# EAGLE design motor_board (EAGLE 8.3.2)
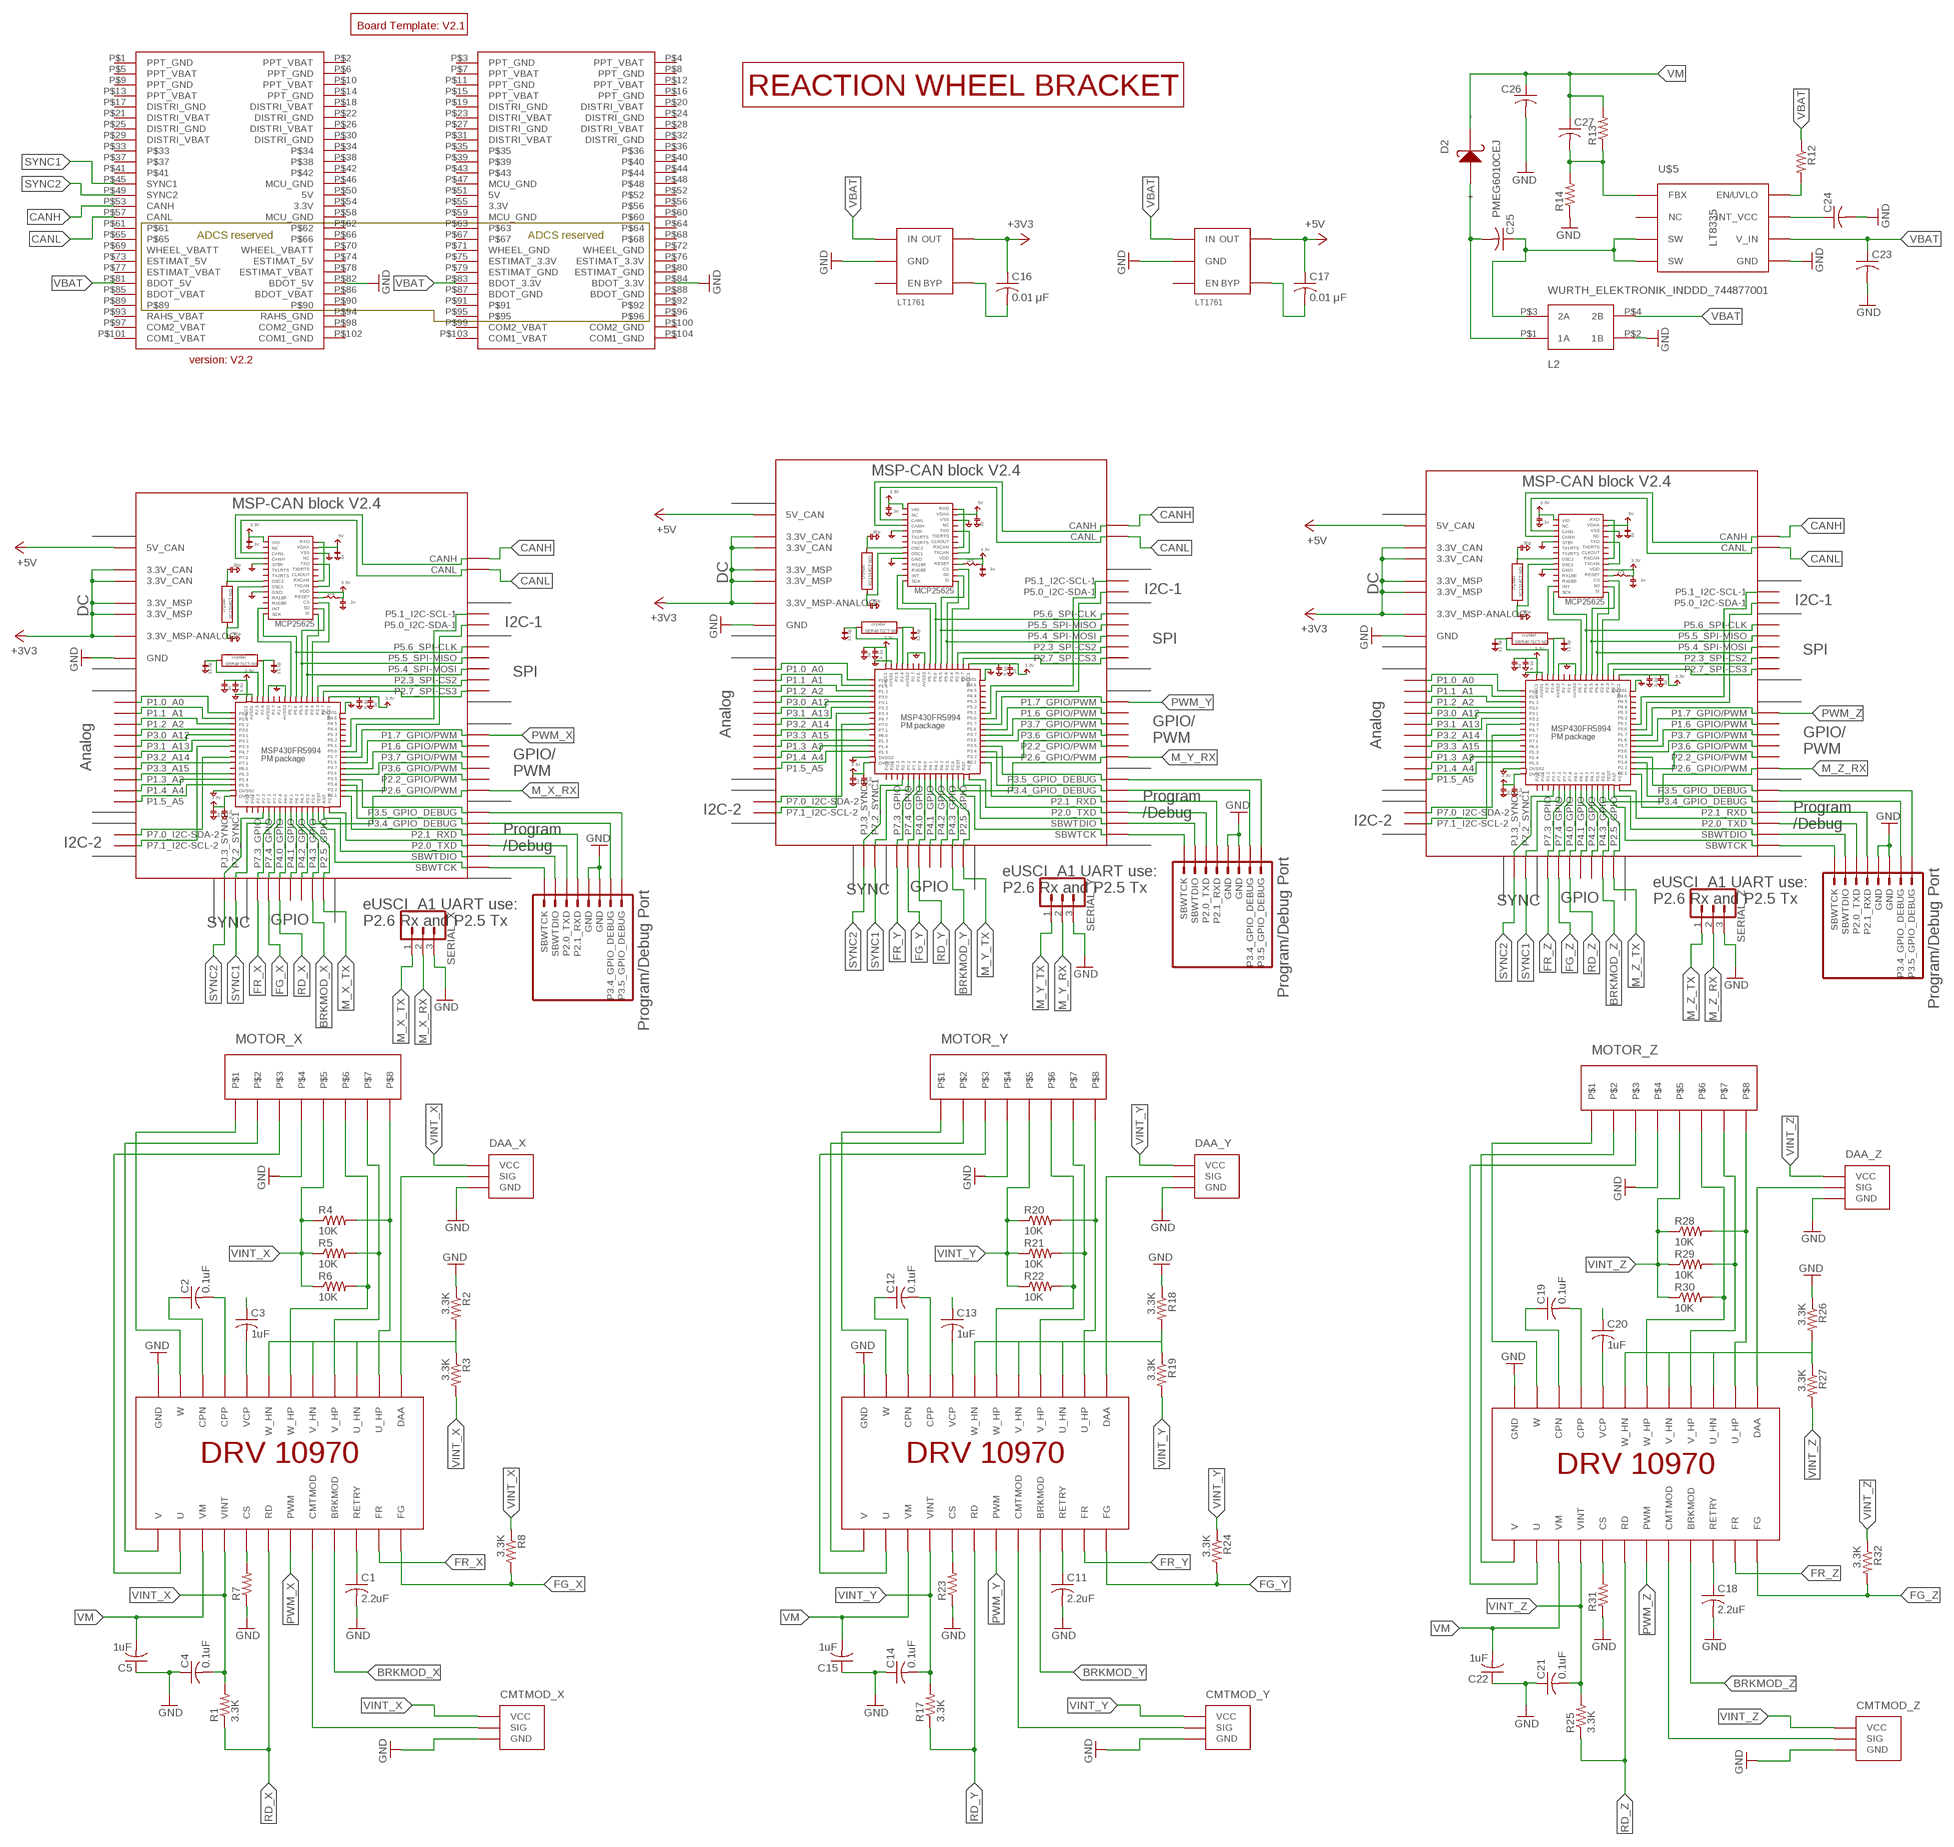
[diagram p0: schematic, sheet 1]

## Parts
C1  2.2uF  C-USC1206  [C1206]
C2  0.1uF  C-USC0805  [C0805]
C3  1uF  C-USC1206  [C1206]
C4  0.1uF  C-USC0805  [C0805]
C5  1uF  C-USC1206  [C1206]
C11  2.2uF  C-USC1206  [C1206]
C12  0.1uF  C-USC0805  [C0805]
C13  1uF  C-USC1206  [C1206]
C14  0.1uF  C-USC0805  [C0805]
C15  1uF  C-USC1206  [C1206]
C16  0.01 μF  C-USC0805  [C0805]
C17  0.01 μF  C-USC0805  [C0805]
C18  2.2uF  C-USC1206  [C1206]
C19  0.1uF  C-USC0805  [C0805]
C20  1uF  C-USC1206  [C1206]
C21  0.1uF  C-USC0805  [C0805]
C22  1uF  C-USC1206  [C1206]
C23  C-USC0805  [C0805]
C24  C-USC0805  [C0805]
C25  C-USC0805  [C0805]
C26  C-USC0805  [C0805]
C27  C-USC0805  [C0805]
CMTMOD_X  0_OHM_JUMPER  [0_OHM_JUMPER]
CMTMOD_Y  0_OHM_JUMPER  [0_OHM_JUMPER]
CMTMOD_Z  0_OHM_JUMPER  [0_OHM_JUMPER]
D2  PMEG6010CEJ  [SC-90]
DAA_X  0_OHM_JUMPER  [0_OHM_JUMPER]
DAA_Y  0_OHM_JUMPER  [0_OHM_JUMPER]
DAA_Z  0_OHM_JUMPER  [0_OHM_JUMPER]
L2  WURTH_ELEKTRONIK_INDDD_744877001  [WURTH_ELEKTRONIK_INDDD_744877001]
LDO_3V3  LINEAR_LDO_LT1761-X  [SOT-23-5]
LDO_5V  LINEAR_LDO_LT1761-X  [SOT-23-5]
MOTOR_X  PICOLOCK_8  [PICOLOCK_8]
MOTOR_Y  PICOLOCK_8  [PICOLOCK_8]
MOTOR_Z  PICOLOCK_8  [PICOLOCK_8]
R1  3.3K  R-US_R0805  [R0805]
R2  3.3K  R-US_R0805  [R0805]
R3  3.3K  R-US_R0805  [R0805]
R4  10K  R-US_R0805  [R0805]
R5  10K  R-US_R0805  [R0805]
R6  10K  R-US_R0805  [R0805]
R7  R-US_R0805  [R0805]
R8  3.3K  R-US_R0805  [R0805]
R12  R-US_R0805  [R0805]
R13  R-US_R0805  [R0805]
R14  R-US_R0805  [R0805]
R17  3.3K  R-US_R0805  [R0805]
R18  3.3K  R-US_R0805  [R0805]
R19  3.3K  R-US_R0805  [R0805]
R20  10K  R-US_R0805  [R0805]
R21  10K  R-US_R0805  [R0805]
R22  10K  R-US_R0805  [R0805]
R23  R-US_R0805  [R0805]
R24  3.3K  R-US_R0805  [R0805]
R25  3.3K  R-US_R0805  [R0805]
R26  3.3K  R-US_R0805  [R0805]
R27  3.3K  R-US_R0805  [R0805]
R28  10K  R-US_R0805  [R0805]
R29  10K  R-US_R0805  [R0805]
R30  10K  R-US_R0805  [R0805]
R31  R-US_R0805  [R0805]
R32  3.3K  R-US_R0805  [R0805]
SERIAL_X  CONN_03LOCK  [1X03_LOCK]
SERIAL_Y  CONN_03LOCK  [1X03_LOCK]
SERIAL_Z  CONN_03LOCK  [1X03_LOCK]
U$1  BOARD_TEMPLATE  [BOARD_TEMPLATE]
U$2  PC104_CONNECTOR  [PC104_CONNECTOR]
U$3  MSP-CAN_BLOCK  [MSP-CAN_BLOCK]
U$4  PROGRAM/DEBUG_PORT  [1X08_CONNECTOR]
U$5  LT8335  [DDB]
U$7  DRV10970  [DRV10970]
U$9  REACTION_WHEEL_BRACKET  [REACTION_WHEEL_BRACKET]
U$10  MSP-CAN_BLOCK  [MSP-CAN_BLOCK]
U$11  PROGRAM/DEBUG_PORT  [1X08_CONNECTOR]
U$12  DRV10970  [DRV10970]
U$13  MSP-CAN_BLOCK  [MSP-CAN_BLOCK]
U$14  PROGRAM/DEBUG_PORT  [1X08_CONNECTOR]
U$15  DRV10970  [DRV10970]

## Nets
+3V3: C16.1 LDO_3V3.P$5(OUT) U$3.3.3V@CAN1(3.3V_CAN) U$3.3.3V@CAN2(3.3V_CAN) U$3.3.3V@MSP1(3.3V_MSP) U$3.3.3V@MSP2(3.3V_MSP) U$3.3.3V_ANALOG@MSP2(3.3V_MSP-ANALOG) U$10.3.3V@CAN1(3.3V_CAN) U$10.3.3V@CAN2(3.3V_CAN) U$10.3.3V@MSP1(3.3V_MSP) U$10.3.3V@MSP2(3.3V_MSP) U$10.3.3V_ANALOG@MSP2(3.3V_MSP-ANALOG) U$13.3.3V@CAN1(3.3V_CAN) U$13.3.3V@CAN2(3.3V_CAN) U$13.3.3V@MSP1(3.3V_MSP) U$13.3.3V@MSP2(3.3V_MSP) U$13.3.3V_ANALOG@MSP2(3.3V_MSP-ANALOG)
+5V: C17.1 LDO_5V.P$5(OUT) U$3.5V(5V_CAN) U$10.5V(5V_CAN) U$13.5V(5V_CAN)
BRKMOD_X: U$3.P4.3_GPIO U$7.BRKMOD
BRKMOD_Y: U$10.P4.3_GPIO U$12.BRKMOD
BRKMOD_Z: U$13.P4.3_GPIO U$15.BRKMOD
CANH: U$2.P$53(CANH) U$3.CANH U$10.CANH U$13.CANH
CANL: U$2.P$57(CANL) U$3.CANL U$10.CANL U$13.CANL
CMTMOD_X: CMTMOD_X.P$2(SIG) U$7.CMTMOD
CMTMOD_Y: CMTMOD_Y.P$2(SIG) U$12.CMTMOD
CMTMOD_Z: CMTMOD_Z.P$2(SIG) U$15.CMTMOD
CPN_X: C2.1 U$7.CPN
CPN_Y: C12.1 U$12.CPN
CPN_Z: C19.1 U$15.CPN
CPP_X: C2.2 U$7.CPP
CPP_Y: C12.2 U$12.CPP
CPP_Z: C19.2 U$15.CPP
CS_X: R7.2 U$7.CS
CS_Y: R23.2 U$12.CS
CS_Z: R31.2 U$15.CS
DAA_X: DAA_X.P$2(SIG) U$7.DAA
DAA_Y: DAA_Y.P$2(SIG) U$12.DAA
DAA_Z: DAA_Z.P$2(SIG) U$15.DAA
EN_UVLO: R12.2 U$5.P$8(EN/UVLO)
FBX: C27.2 R13.1 R14.2 U$5.P$1(FBX)
FG_X: R8.2 U$3.P7.4_GPIO U$7.FG
FG_Y: R24.2 U$10.P7.4_GPIO U$12.FG
FG_Z: R32.2 U$13.P7.4_GPIO U$15.FG
FR_X: U$3.P7.3_GPIO U$7.FR
FR_Y: U$10.P7.3_GPIO U$12.FR
FR_Z: U$13.P7.3_GPIO U$15.FR
GND: C1.2 C3.1 C4.1 C5.1 C11.2 C13.1 C14.1 C15.1 C18.2 C20.1 C21.1 C22.1 C23.2 C24.2 C26.2 CMTMOD_X.P$1(GND) CMTMOD_Y.P$1(GND) CMTMOD_Z.P$1(GND) DAA_X.P$1(GND) DAA_Y.P$1(GND) DAA_Z.P$1(GND) L2.P$2(1B) LDO_3V3.P$2(GND) LDO_5V.P$2(GND) MOTOR_X.P$4 MOTOR_Y.P$4 MOTOR_Z.P$4 R2.1 R7.1 R14.1 R18.1 R23.1 R26.1 R31.1 SERIAL_X.3 SERIAL_Y.3 SERIAL_Z.3 U$2.P$82(BDOT_5V) U$2.P$84(BDOT_3.3V) U$3.GND@1(GND) U$3.GND@2(GND) U$3.GND@3(GND) U$3.GND@4(GND) U$3.GND@5(GND) U$3.GND@7(GND) U$3.GND@8(GND) U$3.GND@9(GND) U$3.GND@10(GND) U$3.GND@11(GND) U$3.GND@12(GND) U$3.GND@13(GND) U$3.GND@14(GND) U$3.GND@15(GND) U$3.GND@16(GND) U$3.GND@17(GND) U$3.GND@26(GND) U$4.5(GND) U$4.6(GND) U$5.GND U$5.P$5(GND) U$7.GND@1(GND) U$7.GND@2(GND) U$10.GND@1(GND) U$10.GND@2(GND) U$10.GND@3(GND) U$10.GND@4(GND) U$10.GND@5(GND) U$10.GND@7(GND) U$10.GND@8(GND) U$10.GND@9(GND) U$10.GND@10(GND) U$10.GND@11(GND) U$10.GND@12(GND) U$10.GND@13(GND) U$10.GND@14(GND) U$10.GND@15(GND) U$10.GND@16(GND) U$10.GND@17(GND) U$10.GND@26(GND) U$11.5(GND) U$11.6(GND) U$12.GND@1(GND) U$12.GND@2(GND) U$13.GND@1(GND) U$13.GND@2(GND) U$13.GND@3(GND) U$13.GND@4(GND) U$13.GND@5(GND) U$13.GND@7(GND) U$13.GND@8(GND) U$13.GND@9(GND) U$13.GND@10(GND) U$13.GND@11(GND) U$13.GND@12(GND) U$13.GND@13(GND) U$13.GND@14(GND) U$13.GND@15(GND) U$13.GND@16(GND) U$13.GND@17(GND) U$13.GND@26(GND) U$14.5(GND) U$14.6(GND) U$15.GND@1(GND) U$15.GND@2(GND)
GPIO_DEBUG_3.4_X: U$3.P3.4_GPIO_DEBUG U$4.7(P3.4_GPIO_DEBUG)
GPIO_DEBUG_3.4_Y: U$10.P3.4_GPIO_DEBUG U$11.7(P3.4_GPIO_DEBUG)
GPIO_DEBUG_3.4_Z: U$13.P3.4_GPIO_DEBUG U$14.7(P3.4_GPIO_DEBUG)
GPIO_DEBUG_3.5_X: U$3.P3.5_GPIO_DEBUG U$4.8(P3.5_GPIO_DEBUG)
GPIO_DEBUG_3.5_Y: U$10.P3.5_GPIO_DEBUG U$11.8(P3.5_GPIO_DEBUG)
GPIO_DEBUG_3.5_Z: U$13.P3.5_GPIO_DEBUG U$14.8(P3.5_GPIO_DEBUG)
HN_X: R2.2 R3.1 U$7.U_HN U$7.V_HN U$7.W_HN
HN_Y: R18.2 R19.1 U$12.U_HN U$12.V_HN U$12.W_HN
HN_Z: R26.2 R27.1 U$15.U_HN U$15.V_HN U$15.W_HN
HP_U_X: MOTOR_X.P$8 R4.2 U$7.U_HP
HP_U_Y: MOTOR_Y.P$8 R20.2 U$12.U_HP
HP_U_Z: MOTOR_Z.P$8 R28.2 U$15.U_HP
HP_V_X: MOTOR_X.P$7 R5.2 U$7.V_HP
HP_V_Y: MOTOR_Y.P$7 R21.2 U$12.V_HP
HP_V_Z: MOTOR_Z.P$7 R29.2 U$15.V_HP
HP_W_X: MOTOR_X.P$6 R6.2 U$7.W_HP
HP_W_Y: MOTOR_Y.P$6 R22.2 U$12.W_HP
HP_W_Z: MOTOR_Z.P$6 R30.2 U$15.W_HP
INT_VCC: C24.1 U$5.P$7(INT_VCC)
M_X_RX: SERIAL_X.2 U$3.P2.6_GPIO/PWM
M_X_TX: SERIAL_X.1 U$3.P2.5_GPIO
M_Y_RX: SERIAL_Y.2 U$10.P2.6_GPIO/PWM
M_Y_TX: SERIAL_Y.1 U$10.P2.5_GPIO
M_Z_RX: SERIAL_Z.2 U$13.P2.6_GPIO/PWM
M_Z_TX: SERIAL_Z.1 U$13.P2.5_GPIO
N$1: C25.2 D2.P$1(+) L2.P$1(1A)
N$13: C17.2 LDO_5V.P$4(BYP)
N$14: C16.2 LDO_3V3.P$4(BYP)
PWM_X: U$3.P1.7_GPIO/PWM U$7.PWM
PWM_Y: U$10.P1.7_GPIO/PWM U$12.PWM
PWM_Z: U$13.P1.7_GPIO/PWM U$15.PWM
RD_X: R1.1 U$3.P4.0_GPIO U$7.RD
RD_Y: R17.1 U$10.P4.0_GPIO U$12.RD
RD_Z: R25.1 U$13.P4.0_GPIO U$15.RD
RETRY_X: C1.1 U$7.RETRY
RETRY_Y: C11.1 U$12.RETRY
RETRY_Z: C18.1 U$15.RETRY
RXD_X: U$3.P2.1_RXD U$4.4(P2.1_RXD)
RXD_Y: U$10.P2.1_RXD U$11.4(P2.1_RXD)
RXD_Z: U$13.P2.1_RXD U$14.4(P2.1_RXD)
SBWTCK_X: U$3.SBWTCK U$4.SBWTCK
SBWTCK_Y: U$10.SBWTCK U$11.SBWTCK
SBWTCK_Z: U$13.SBWTCK U$14.SBWTCK
SBWTDIO_X: U$3.SBWTDIO U$4.2(SBWTDIO)
SBWTDIO_Y: U$10.SBWTDIO U$11.2(SBWTDIO)
SBWTDIO_Z: U$13.SBWTDIO U$14.2(SBWTDIO)
SW: C25.1 L2.P$3(2A) U$5.P$3(SW) U$5.P$4(SW)
SYNC1: U$2.P$45(SYNC1) U$3.P7.2_SYNC1 U$10.P7.2_SYNC1 U$13.P7.2_SYNC1
SYNC2: U$2.P$49(SYNC2) U$3.PJ.3_SYNC2 U$10.PJ.3_SYNC2 U$13.PJ.3_SYNC2
TXD_X: U$3.P2.0_TXD U$4.3(P2.0_TXD)
TXD_Y: U$10.P2.0_TXD U$11.3(P2.0_TXD)
TXD_Z: U$13.P2.0_TXD U$14.3(P2.0_TXD)
U_X: MOTOR_X.P$3 U$7.U
U_Y: MOTOR_Y.P$3 U$12.U
U_Z: MOTOR_Z.P$3 U$15.U
V_X: MOTOR_X.P$2 U$7.V
V_Y: MOTOR_Y.P$2 U$12.V
V_Z: MOTOR_Z.P$2 U$15.V
VBAT: C23.1 L2.P$4(2B) LDO_3V3.P$1(IN) LDO_5V.P$1(IN) R12.1 U$2.P$81(BDOT_5V) U$2.P$83(BDOT_3.3V) U$5.P$6(V_IN)
VCP_X: C3.2 U$7.VCP
VCP_Y: C13.2 U$12.VCP
VCP_Z: C20.2 U$15.VCP
VINT_X: C4.2 CMTMOD_X.P$3(VCC) DAA_X.P$3(VCC) MOTOR_X.P$5 R1.2 R3.2 R4.1 R5.1 R6.1 R8.1 U$7.VINT
VINT_Y: C14.2 CMTMOD_Y.P$3(VCC) DAA_Y.P$3(VCC) MOTOR_Y.P$5 R17.2 R19.2 R20.1 R21.1 R22.1 R24.1 U$12.VINT
VINT_Z: C21.2 CMTMOD_Z.P$3(VCC) DAA_Z.P$3(VCC) MOTOR_Z.P$5 R25.2 R27.2 R28.1 R29.1 R30.1 R32.1 U$15.VINT
VM: C5.2 C15.2 C22.2 C26.1 C27.1 D2.P$2(-) R13.2 U$7.VM U$12.VM U$15.VM
W_X: MOTOR_X.P$1 U$7.W
W_Y: MOTOR_Y.P$1 U$12.W
W_Z: MOTOR_Z.P$1 U$15.W
Unconnected: LDO_3V3.P$3(EN) LDO_5V.P$3(EN) U$2.P$1(PPT_GND) U$2.P$2(PPT_VBAT) U$2.P$3(PPT_GND) U$2.P$4(PPT_VBAT) U$2.P$5(PPT_VBAT) U$2.P$6(PPT_GND) U$2.P$7(PPT_VBAT) U$2.P$8(PPT_GND) U$2.P$9(PPT_GND) U$2.P$10(PPT_VBAT) U$2.P$11(PPT_GND) U$2.P$12(PPT_VBAT) U$2.P$13(PPT_VBAT) U$2.P$14(PPT_GND) U$2.P$15(PPT_VBAT) U$2.P$16(PPT_GND) U$2.P$17(DISTRI_GND) U$2.P$18(DISTRI_VBAT) U$2.P$19(DISTRI_GND) U$2.P$20(DISTRI_VBAT) U$2.P$21(DISTRI_VBAT) U$2.P$22(DISTRI_GND) U$2.P$23(DISTRI_VBAT) U$2.P$24(DISTRI_GND) U$2.P$25(DISTRI_GND) U$2.P$26(DISTRI_VBAT) U$2.P$27(DISTRI_GND) U$2.P$28(DISTRI_VBAT) U$2.P$29(DISTRI_VBAT) U$2.P$30(DISTRI_GND) U$2.P$31(DISTRI_VBAT) U$2.P$32(DISTRI_GND) U$2.P$33 U$2.P$34 U$2.P$35 U$2.P$36 U$2.P$37 U$2.P$38 U$2.P$39 U$2.P$40 U$2.P$41 U$2.P$42 U$2.P$43 U$2.P$44 U$2.P$46(MCU_GND) U$2.P$47(MCU_GND) U$2.P$48 U$2.P$50(5V) U$2.P$51(5V) U$2.P$52 U$2.P$54(3.3V) U$2.P$55(3.3V) U$2.P$56 U$2.P$58(MCU_GND) U$2.P$59(MCU_GND) U$2.P$60 U$2.P$61 U$2.P$62 U$2.P$63 U$2.P$64 U$2.P$65 U$2.P$66 U$2.P$67 U$2.P$68 U$2.P$69(WHEEL_VBATT) U$2.P$70(WHEEL_VBATT) U$2.P$71(WHEEL_GND) U$2.P$72(WHEEL_GND) U$2.P$73(ESTIMAT_5V) U$2.P$74(ESTIMAT_5V) U$2.P$75(ESTIMAT_3.3V) U$2.P$76(ESTIMAT_3.3V) U$2.P$77(ESTIMAT_VBAT) U$2.P$78(ESTIMAT_VBAT) U$2.P$79(ESTIMAT_GND) U$2.P$80(ESTIMAT_GND) U$2.P$85(BDOT_VBAT) U$2.P$86(BDOT_VBAT) U$2.P$87(BDOT_GND) U$2.P$88(BDOT_GND) U$2.P$89 U$2.P$90 U$2.P$91 U$2.P$92 U$2.P$93(RAHS_VBAT) U$2.P$94(RAHS_GND) U$2.P$95 U$2.P$96 U$2.P$97(COM2_VBAT) U$2.P$98(COM2_GND) U$2.P$99(COM2_VBAT) U$2.P$100(COM2_GND) U$2.P$101(COM1_VBAT) U$2.P$102(COM1_GND) U$2.P$103(COM1_VBAT) U$2.P$104(COM1_GND) U$3.P1.0_A0 U$3.P1.1_A1 U$3.P1.2_A2 U$3.P1.3_A3 U$3.P1.4_A4 U$3.P1.5_A5 U$3.P1.6_GPIO/PWM U$3.P2.2_GPIO/PWM U$3.P2.4_SPI-CS2(P2.3_SPI-CS2) U$3.P2.7_SPI-CS3 U$3.P3.0_A12 U$3.P3.1_A13 U$3.P3.2_A14 U$3.P3.3_A15 U$3.P3.6_GPIO/PWM U$3.P3.7_GPIO/PWM U$3.P4.1_GPIO U$3.P4.2_GPIO U$3.P5.0_I2C-SDA-1 U$3.P5.1_I2C-SCL-1 U$3.P5.4_SPI-MOSI U$3.P5.5_SPI-MISO U$3.P5.6_SPI-CLK U$3.P7.0_I2C-SDA-2 U$3.P7.1_I2C-SCL-2 U$5.P$2(NC) U$10.P1.0_A0 U$10.P1.1_A1 U$10.P1.2_A2 U$10.P1.3_A3 U$10.P1.4_A4 U$10.P1.5_A5 U$10.P1.6_GPIO/PWM U$10.P2.2_GPIO/PWM U$10.P2.4_SPI-CS2(P2.3_SPI-CS2) U$10.P2.7_SPI-CS3 U$10.P3.0_A12 U$10.P3.1_A13 U$10.P3.2_A14 U$10.P3.3_A15 U$10.P3.6_GPIO/PWM U$10.P3.7_GPIO/PWM U$10.P4.1_GPIO U$10.P4.2_GPIO U$10.P5.0_I2C-SDA-1 U$10.P5.1_I2C-SCL-1 U$10.P5.4_SPI-MOSI U$10.P5.5_SPI-MISO U$10.P5.6_SPI-CLK U$10.P7.0_I2C-SDA-2 U$10.P7.1_I2C-SCL-2 U$13.P1.0_A0 U$13.P1.1_A1 U$13.P1.2_A2 U$13.P1.3_A3 U$13.P1.4_A4 U$13.P1.5_A5 U$13.P1.6_GPIO/PWM U$13.P2.2_GPIO/PWM U$13.P2.4_SPI-CS2(P2.3_SPI-CS2) U$13.P2.7_SPI-CS3 U$13.P3.0_A12 U$13.P3.1_A13 U$13.P3.2_A14 U$13.P3.3_A15 U$13.P3.6_GPIO/PWM U$13.P3.7_GPIO/PWM U$13.P4.1_GPIO U$13.P4.2_GPIO U$13.P5.0_I2C-SDA-1 U$13.P5.1_I2C-SCL-1 U$13.P5.4_SPI-MOSI U$13.P5.5_SPI-MISO U$13.P5.6_SPI-CLK U$13.P7.0_I2C-SDA-2 U$13.P7.1_I2C-SCL-2

## Library data of the parts
C1-C5 C11-C27 = rcl:C-US: CAPACITOR, American symbol
CMTMOD_X CMTMOD_Y CMTMOD_Z DAA_X DAA_Y DAA_Z = DubSat1 Components:0_OHM_JUMPER
D2 = DubSat1 Components:PMEG6010CEJ
L2 = DubSat1 Components:WURTH_ELEKTRONIK_INDDD_744877001
LDO_3V3 LDO_5V = DubSat1 Components:LINEAR_LDO_LT1761-X
MOTOR_X MOTOR_Y MOTOR_Z = DubSat1 Components:PICOLOCK_8
R1-R8 R12-R14 R17-R32 = rcl:R-US_: RESISTOR, American symbol
SERIAL_X SERIAL_Y SERIAL_Z = SparkFun-Connectors:CONN_03: Multi connection point. Often used as Generic Header-pin footprint for 0.1 inch spaced/style header connections On any of the 0.1 inch spaced packages, you can populate with these: Break Away Headers - Straight <https://www.sparkfun.com/products/116> (PRT-00116) Break Away Male Headers - Right Angle <https://www.sparkfun.com/products/553> (PRT-00553) Female Headers <https://www.sparkfun.com/products/115> (PRT-00115) Break Away Headers - Machine Pin <https://www.sparkfun.com/products/117> (PRT-00117) Break Away Female Headers - Swiss Machine Pin <https://www.sparkfun.com/products/743> (PRT-00743) Stackable Header - 3 Pin (Female, 0.1") <https://www.sparkfun.com/products/13875> (PRT-13875) For SCREWTERMINALS and SPRING TERMINALS visit here: Screw Terimnals on SparkFun.com <https://www.sparkfun.com/search/results?term=Screw+Terminals> (5mm/3.5mm/2.54mm spacing) This device is also useful as a general connection point to wire up your design to another part of your project. Our various solder wires solder well into these plated through hole pads. Hook-Up Wire - Assortment (Stranded, 22 AWG) <https://www.sparkfun.com/products/11375> (PRT-11375) Hook-Up Wire - Assortment (Solid Core, 22 AWG) <https://www.sparkfun.com/products/11367> (PRT-11367) View the entire wire category on our website here <https://www.sparkfun.com/categories/141> Special notes: Molex polarized connector foot print use with SKU : PRT-08232 with associated crimp pins and housings.
U$1 = DubSat1 Components:BOARD_TEMPLATE
U$2 = DubSat1 Components:PC104_CONNECTOR
U$3 U$10 U$13 = DubSat1 Components:MSP-CAN_BLOCK
U$4 U$11 U$14 = DubSat1 Components:PROGRAM/DEBUG_PORT
U$5 = DubSat1 Components:LT8335
U$7 U$12 U$15 = DubSat1 Components:DRV10970
U$9 = DubSat1 Components:REACTION_WHEEL_BRACKET

## Net classes
0 default: width 0.254 mm, drill 0.254 mm, clearance 0.152 mm

## Board
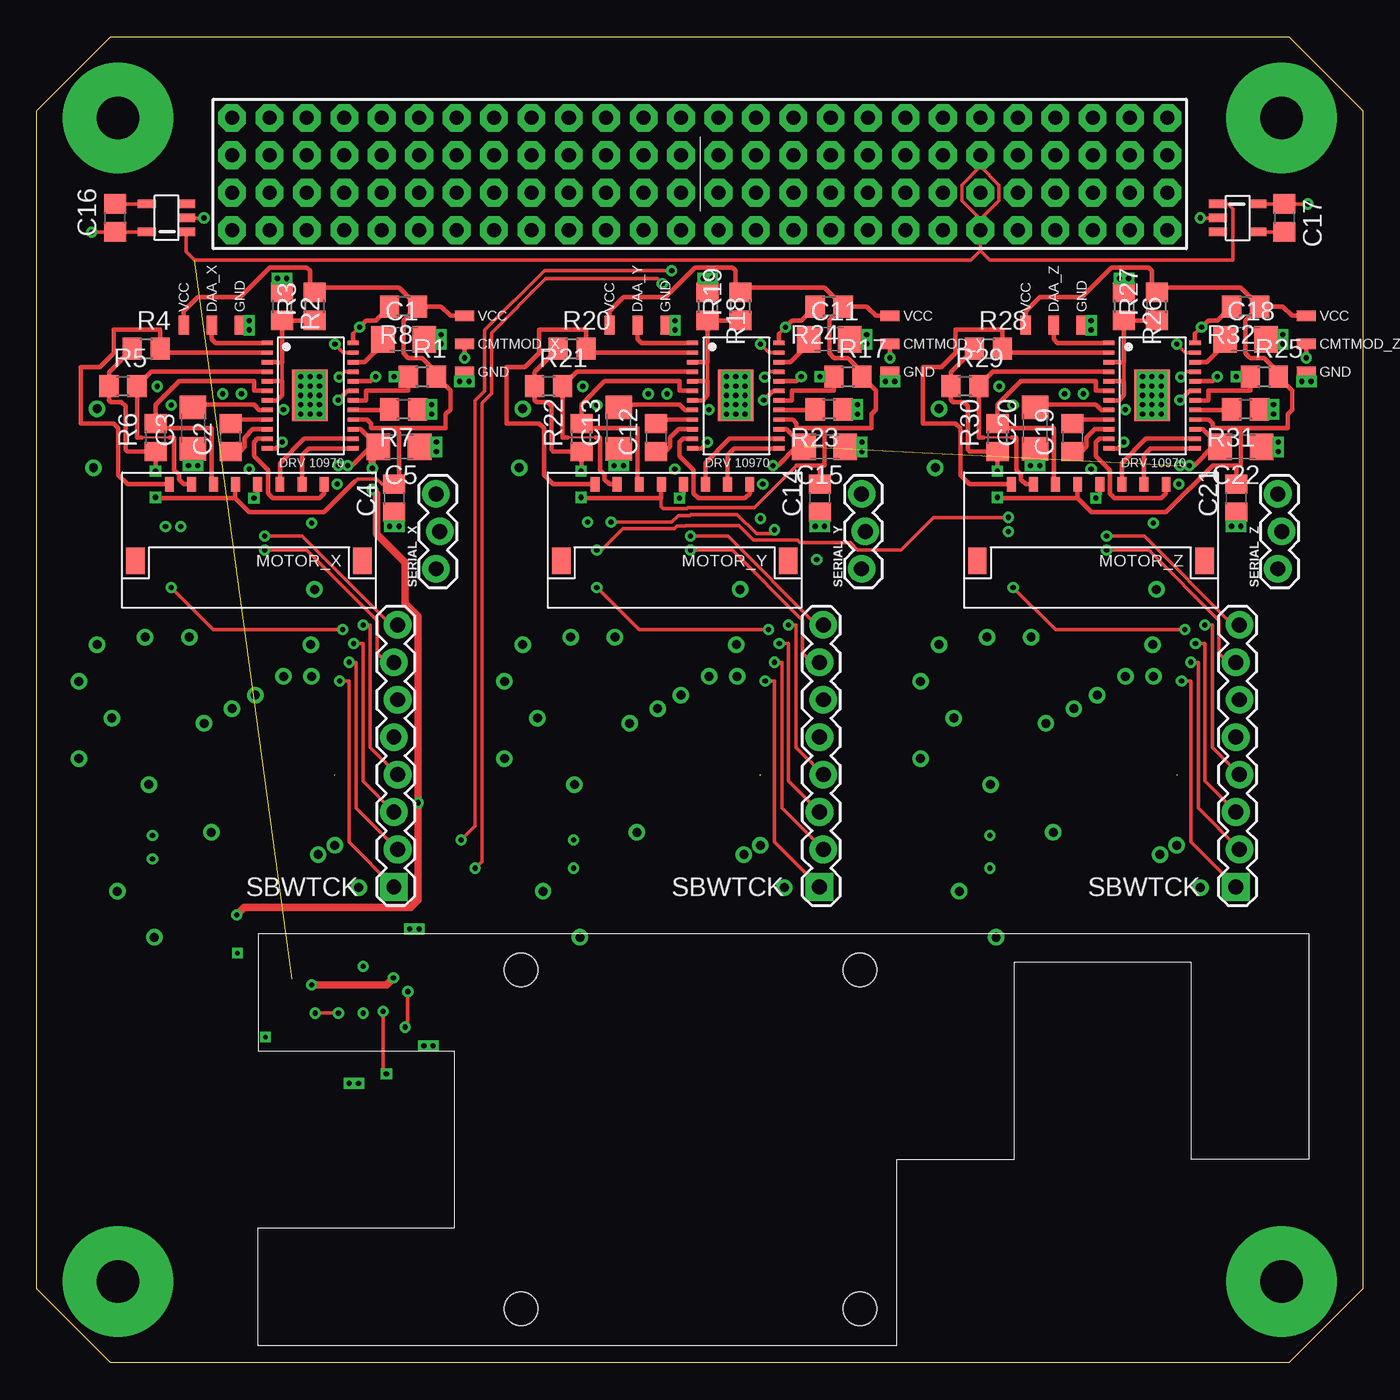
[diagram p1: board, top side]
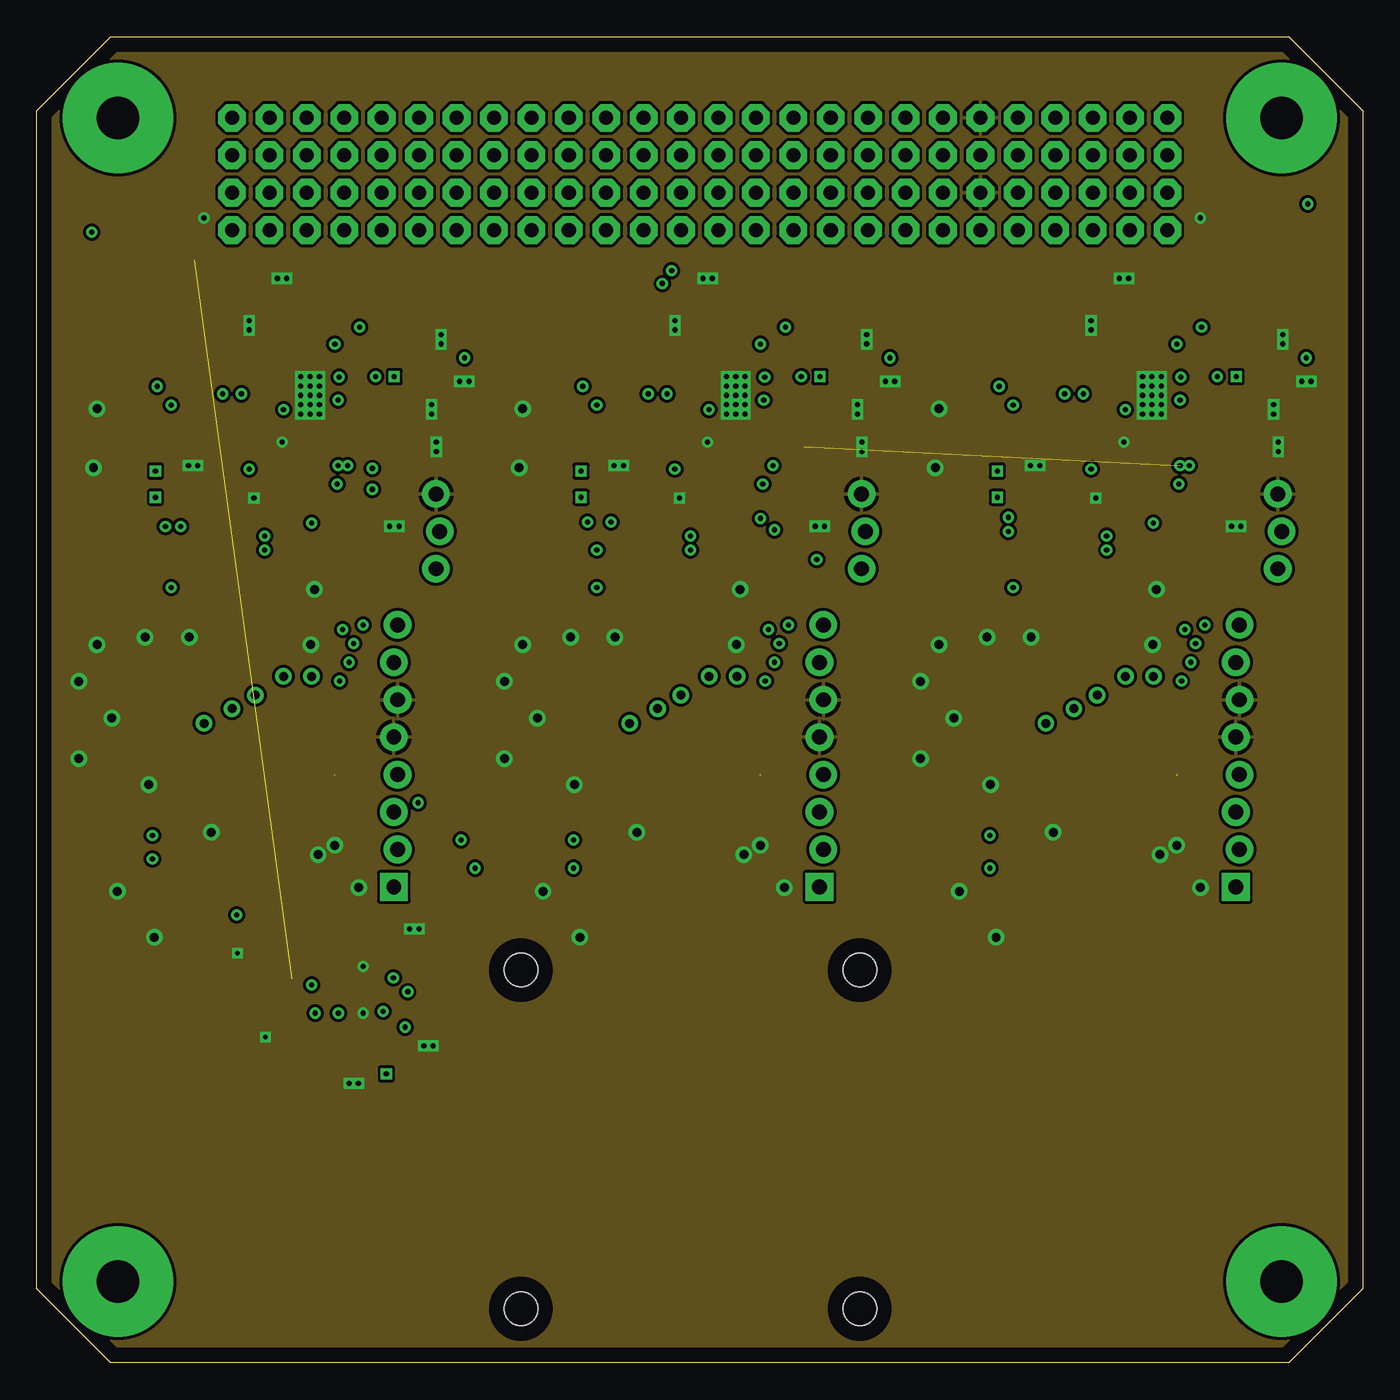
[diagram p2: board, inner layer Ground]
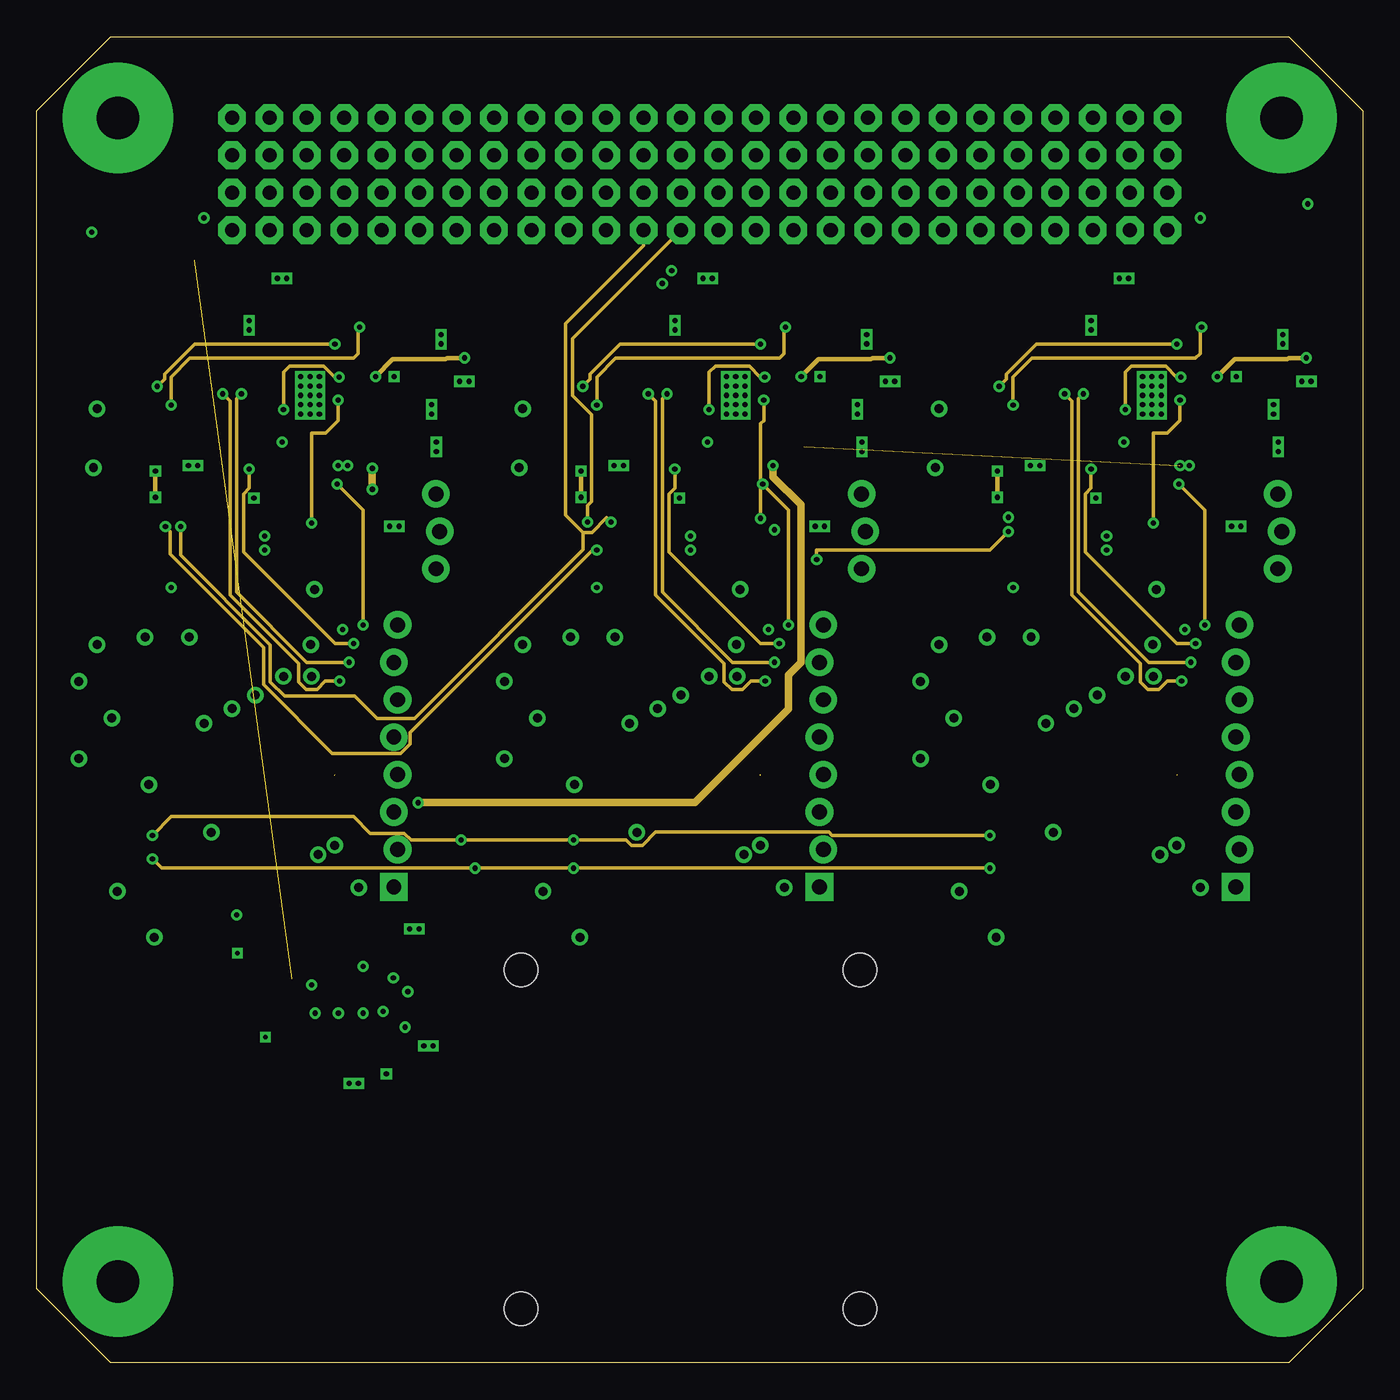
[diagram p3: board, inner layer Signal]
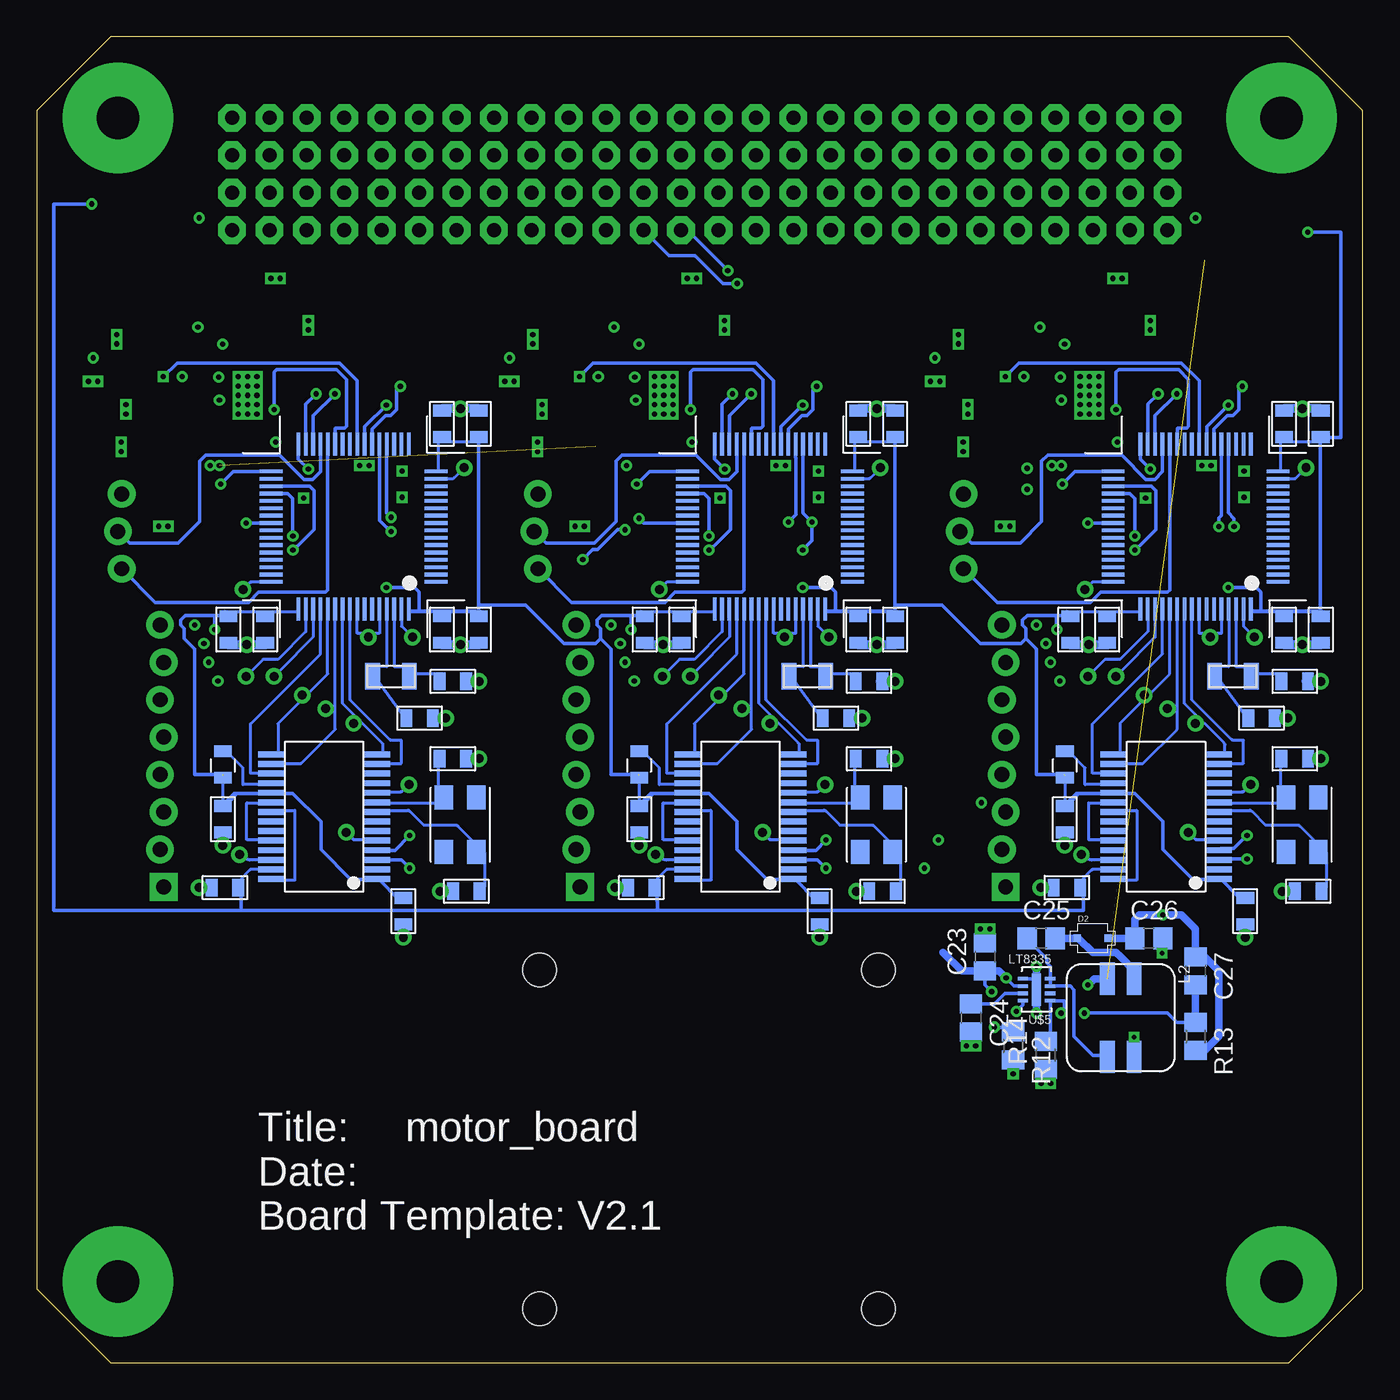
[diagram p4: board, bottom side, seen from below]

Size 90 x 90 mm. Coordinates in mm from the lower left corner, seen from the top.
Copper layers (1*2*3*16): Top 0.035mm / dielectric 1.5mm / Ground 0.035mm / dielectric 0.15mm / Signal 0.035mm / dielectric 0.2mm / Bottom 0.035mm
Design rules "default *": minimum track width 8mil, minimum drill 0.4mm, track to track 8mil, track to pad 8mil, pad to pad 8mil, via to via 8mil, smd to smd 8mil, copper to edge 40mil, drill to drill 8mil, minimum pad ring 10mil, minimum via ring 8mil, stop-mask expansion 4mil, vias tented up to drill 0mil, thermal gap 10mil

### Footprints (pad centres in the part's own frame; a part is rotated, then mirrored left to right if it is on the bottom)
C1206 = smd 1.6 x 1.8: 1 -1.4,0; 2 1.4,0
C0805 = smd 1.3 x 1.5: 1 -0.95,0; 2 0.95,0
0_OHM_JUMPER = smd 1.3 x 0.7: P$1 0,-1.9; P$2 0,0; P$3 0,1.9
SC-90 = smd 0.5 x 0.5: P$1 -1.05,0; P$2 1.05,0
WURTH_ELEKTRONIK_INDDD_744877001 = smd 1 x 2.2: P$1 -0.9,-2.65; P$2 -0.9,2.65; P$3 0.9,2.65; P$4 0.9,-2.65
SOT-23-5 = smd 0.6 x 1.2: P$1 -0.95,-1.35; P$2 0,-1.35; P$3 0.95,-1.35; P$4 0.95,1.35; P$5 -0.95,1.35
PICOLOCK_8 = smd 1.25 x 1.8: MNT@1 -2.605,5.2; MNT@2 12.805,5.2 | smd 0.6 x 1: P$1 0,0; P$2 1.5,0; P$3 3,0; P$4 4.5,0; P$5 6,0; P$6 7.5,0; P$7 9,0; P$8 10.5,0
R0805 = smd 1.3 x 1.5: 1 -0.95,0; 2 0.95,0
1X03_LOCK = drill 1.016 pad 1.88: 1 0,0.127; 2 2.54,-0.127; 3 5.08,0.127
BOARD_TEMPLATE = drill 2.9 pad 7.5: P$1 -39.5,39.5; P$2 -39.5,-39.5; P$3 39.5,-39.5; P$4 39.5,39.5
PC104_CONNECTOR = drill 0.953 pad 1.88 octagon: P$1 -31.75,31.88; P$2 -31.75,34.42; P$3 -31.75,36.96; P$4 -31.75,39.5; P$5 -29.21,31.88; P$6 -29.21,34.42; P$7 -29.21,36.96; P$8 -29.21,39.5; P$9 -26.67,31.88; P$10 -26.67,34.42; P$11 -26.67,36.96; P$12 -26.67,39.5; P$13 -24.13,31.88; P$14 -24.13,34.42; P$15 -24.13,36.96; P$16 -24.13,39.5; P$17 -21.59,31.88; P$18 -21.59,34.42; P$19 -21.59,36.96; P$20 -21.59,39.5; P$21 -19.05,31.88; P$22 -19.05,34.42; P$23 -19.05,36.96; P$24 -19.05,39.5; P$25 -16.51,31.88; P$26 -16.51,34.42; P$27 -16.51,36.96; P$28 -16.51,39.5; P$29 -13.97,31.88; P$30 -13.97,34.42; P$31 -13.97,36.96; P$32 -13.97,39.5; P$33 -11.43,31.88; P$34 -11.43,34.42; P$35 -11.43,36.96; P$36 -11.43,39.5; P$37 -8.89,31.88; P$38 -8.89,34.42; P$39 -8.89,36.96; P$40 -8.89,39.5; P$41 -6.35,31.88; P$42 -6.35,34.42; P$43 -6.35,36.96; P$44 -6.35,39.5; P$45 -3.81,31.88; P$46 -3.81,34.42; P$47 -3.81,36.96; P$48 -3.81,39.5; P$49 -1.27,31.88; P$50 -1.27,34.42; P$51 -1.27,36.96; P$52 -1.27,39.5; P$53 1.27,31.88; P$54 1.27,34.42; P$55 1.27,36.96; P$56 1.27,39.5; P$57 3.81,31.88; P$58 3.81,34.42; P$59 3.81,36.96; P$60 3.81,39.5; P$61 6.35,31.88; P$62 6.35,34.42; P$63 6.35,36.96; P$64 6.35,39.5; P$65 8.89,31.88; P$66 8.89,34.42; P$67 8.89,36.96; P$68 8.89,39.5; P$69 11.43,31.88; P$70 11.43,34.42; P$71 11.43,36.96; P$72 11.43,39.5; P$73 13.97,31.88; P$74 13.97,34.42; P$75 13.97,36.96; P$76 13.97,39.5; P$77 16.51,31.88; P$78 16.51,34.42; P$79 16.51,36.96; P$80 16.51,39.5; P$81 19.05,31.88; P$82 19.05,34.42; P$83 19.05,36.96; P$84 19.05,39.5; P$85 21.59,31.88; P$86 21.59,34.42; P$87 21.59,36.96; P$88 21.59,39.5; P$89 24.13,31.88; P$90 24.13,34.42; P$91 24.13,36.96; P$92 24.13,39.5; P$93 26.67,31.88; P$94 26.67,34.42; P$95 26.67,36.96; P$96 26.67,39.5; P$97 29.21,31.88; P$98 29.21,34.42; P$99 29.21,36.96; P$100 29.21,39.5; P$101 31.75,31.88; P$102 31.75,34.42; P$103 31.75,36.96; P$104 31.75,39.5
MSP-CAN_BLOCK = smd 1.2 x 0.8: 1 -6,6.08; 2 -6,7.88; 3 -8.5,6.08; 4 -8.5,7.88; 9 -8.5,-6.08; 10 -8.5,-7.88; 11 -6,-6.08; 12 -6,-7.88; 13 8.5,6.08; 14 8.5,7.88; 15 6,6.08; 16 6,7.88; 23 8.875,18.955; 24 8.875,20.755; 25 8.875,17.045; 26 8.875,15.245; 27 -3.375,25.205; 28 -3.375,27.005 | smd 1 x 0.25: 3.3V@CAN1 -3.375,25.125; 3.3V@CAN2 8.875,18.875; 3.3V@MSP1 8.501,5.884; 3.3V@MSP2 -8.533,-5.962; 3.3V_ANALOG@MSP2 -8.482,5.904 | smd 0.8 x 1.2: 5 -5.83,10.5; 6 -7.63,10.5; 7 -3.58,13; 8 -5.38,13; 17 -8.545,24.75; 18 -6.745,24.75; 19 -5.83,15.75; 20 -7.63,15.75; 21 7.83,24.5; 22 9.63,24.5 | smd 0.25 x 1: 5V 7.65,24.5 | smd 1.75 x 0.4: CANH -1.6,21.96; CANL -1.6,22.61; P$65 -1.6,23.91; P$66 -1.6,23.26; P$69 -1.6,21.31; P$70 -1.6,20.66; P$71 -1.6,20.01; P$72 -1.6,19.36; P$73 -1.6,18.71; P$74 -1.6,18.06; P$75 -1.6,17.41; P$76 -1.6,16.76; P$77 -1.6,16.11; P$78 -1.6,15.46; P$79 5.6,15.46; P$80 5.6,16.11; P$81 5.6,16.76; P$82 5.6,17.41; P$83 5.6,18.06; P$84 5.6,18.71; P$85 5.6,19.36; P$86 5.6,20.01; P$87 5.6,20.66; P$88 5.6,21.31; P$89 5.6,21.96; P$90 5.6,22.61; P$91 5.6,23.26; P$92 5.6,23.91 | drill 0.61: GND@1 -3.375,27.875; GND@2 -5.875,24.75; GND@3 -3.75,17.5; GND@4 0.5,20.75; GND@5 -8.5,15.75; GND@7 -8.5,10.5; GND@8 -7.25,8; GND@9 -4,7.5; GND@10 -1,7.5; GND@11 7.75,22.25; GND@12 10.5,24.5; GND@13 8.875,21.625; GND@14 7.25,8; GND@15 7.5,4.25; GND@16 -7.5,-4; GND@17 -7.25,-8; GND@26 -6.25,13; P2.4_SPI-CS2 5.397,10.16; P2.7_SPI-CS3 7.303,10.16; P5.4_SPI-MOSI 3.487,11.434; P5.5_SPI-MISO 1.9,12.354; P5.6_SPI-CLK 0,13.348 | smd 1.55 x 0.25: P1.0_A0 -5.6,3.75; P1.1_A1 -5.6,3.25; P1.2_A2 -5.6,2.75; P1.3_A3 -5.6,-1.75; P1.4_A4 -5.6,-2.25; P1.5_A5 -5.6,-2.75; P1.6_GPIO/PWM 5.6,-0.75; P1.7_GPIO/PWM 5.6,-0.25; P2.1_RXD 5.6,-3.75; P2.2_GPIO/PWM 5.6,-3.25; P3.0_A12 -5.6,2.25; P3.1_A13 -5.6,1.75; P3.2_A14 -5.6,1.25; P3.3_A15 -5.6,0.75; P3.4_GPIO_DEBUG 5.6,-2.75; P3.5_GPIO_DEBUG 5.6,-2.25; P3.6_GPIO/PWM 5.6,-1.75; P3.7_GPIO/PWM 5.6,-1.25; P5.0_I2C-SDA-1 5.6,0.25; P5.1_I2C-SCL-1 5.6,0.75; P7.0_I2C-SDA-2 -5.6,-0.25; P7.1_I2C-SCL-2 -5.6,-0.75; P$8 -5.6,0.25; P$11 -5.6,-1.25; P$15 -5.6,-3.25; P$16 -5.6,-3.75; P$43 5.6,1.25; P$44 5.6,1.75; P$45 5.6,2.25; P$46 5.6,2.75; P$47 5.6,3.25; P$48 5.6,3.75 | smd 0.25 x 1.55: P2.0_TXD 3.75,-5.6; P2.5_GPIO 1.75,-5.6; P2.6_GPIO/PWM 2.25,-5.6; P4.0_GPIO -0.25,-5.6; P4.1_GPIO 0.25,-5.6; P4.2_GPIO 0.75,-5.6; P4.3_GPIO 1.25,-5.6; P7.2_SYNC1 -1.75,-5.6; P7.3_GPIO -1.25,-5.6; P7.4_GPIO -0.75,-5.6; P$17 -3.75,-5.6; P$18 -3.25,-5.6; P$19 -2.75,-5.6; P$49 3.75,5.6; P$50 3.25,5.6; P$51 2.75,5.6; P$52 2.25,5.6; P$53 1.75,5.6; P$54 1.25,5.6; P$55 0.75,5.6; P$56 0.25,5.6; P$57 -0.25,5.6; P$58 -0.75,5.6; P$59 -1.25,5.6; P$60 -1.75,5.6; P$61 -2.25,5.6; P$62 -2.75,5.6; P$63 -3.25,5.6; P$64 -3.75,5.6; PJ.3_SYNC2 -2.25,-5.6; SBWTCK 2.75,-5.6; SBWTDIO 3.25,-5.6 | smd 1 x 1.8: P$93 -3.79,10.16; P$94 -1.29,10.16 | smd 1.25 x 1.6: P$104 -6.13,18.38; P$105 -6.13,22.08; P$106 -8.33,22.08; P$107 -8.33,18.38
1X08_CONNECTOR = drill 1.016 pad 1.88: 2 2.54,-0.127; 3 5.08,0.127; 4 7.62,-0.127; 5 10.16,0.127; 6 12.7,-0.127; 7 15.24,0.127; 8 17.78,-0.127 | drill 1.016 pad 1.88 square: SBWTCK 0,0.127
DDB = smd 0.61 x 2.2: GND 0,0 | smd 0.7 x 0.25: P$1 -0.925,0.75; P$2 -0.925,0.25; P$3 -0.925,-0.25; P$4 -0.925,-0.75; P$5 0.925,-0.75; P$6 0.925,-0.25; P$7 0.925,0.25; P$8 0.925,0.75
DRV10970 = smd 0.3 x 0.75: BRKMOD -1.6,2.925; CMTMOD -0.95,2.925; CPN 2.3,-2.925; CPP 1.65,-2.925; CS 1,2.925; DAA -3.55,-2.925; FG -3.55,2.925; FR -2.9,2.925; GND@1 3.6,-2.925; PWM -0.3,2.925; RD 0.35,2.925; RETRY -2.25,2.925; U 2.95,2.925; U_HN -2.25,-2.925; U_HP -2.9,-2.925; V 3.6,2.925; V_HN -0.95,-2.925; V_HP -1.6,-2.925; VCP 1,-2.925; VINT 1.65,2.925; VM 2.3,2.925; W 2.95,-2.925; W_HN 0.35,-2.925; W_HP -0.3,-2.925 | smd 3.5 x 2.4: GND@2 0,0
REACTION_WHEEL_BRACKET = hole 2.286: -11.5,11.5; 11.5,11.5; 11.5,-11.5; -11.5,-11.5

### Placement (x,y rotation side)
C1  24.9,69.47 0 top
C2  13.15,62.81 90 top
C3  10.61,63.44 90 top
C4  24.26,58.68 90 top
C5  24.58,62.17 180 top
C11  53.79,69.47 0 top
C12  42.04,62.81 90 top
C13  39.5,63.44 90 top
C14  53.16,58.68 90 top
C15  53.47,62.17 180 top
C16  5.31,77.7 90 top
C17  84.69,77.7 270 top
C18  82.05,69.47 0 top
C19  70.3,62.81 90 top
C20  67.76,63.44 90 top
C21  81.41,58.68 90 top
C22  81.73,62.17 180 top
C23  25.63,27.54 90 bottom
C24  26.59,23.41 270 bottom
C25  21.82,28.81 0 bottom
C26  14.52,28.81 0 bottom
C27  11.35,26.59 270 bottom
CMTMOD_X  29.03,69.16 0 top
CMTMOD_Y  57.92,69.16 0 top
CMTMOD_Z  86.18,69.16 0 top
D2  18.33,28.81 0 bottom
DAA_X  11.88,70.43 90 top
DAA_Y  40.77,70.43 90 top
DAA_Z  69.03,70.43 90 top
L2  16.43,23.41 180 bottom
LDO_3V3  8.81,77.7 90 top
LDO_5V  81.51,77.7 270 top
MOTOR_X  19.5,59.63 180 top
MOTOR_Y  48.39,59.63 180 top
MOTOR_Z  76.65,59.63 180 top
R1  26.17,66.93 0 top
R2  16.64,71.7 270 top
R3  18.87,71.7 90 top
R4  7.44,68.84 0 top
R5  5.85,66.3 0 top
R6  8.07,62.81 90 top
R7  24.9,64.71 180 top
R8  24.9,71.7 180 top
R12  23.73,21.51 270 bottom
R13  11.35,22.14 270 bottom
R14  21.51,20.87 90 bottom
R17  55.06,66.93 0 top
R18  45.54,71.7 270 top
R19  47.76,71.7 90 top
R20  36.33,68.84 0 top
R21  34.74,66.3 0 top
R22  36.96,62.81 90 top
R23  53.79,64.71 180 top
R24  53.79,71.7 180 top
R25  83.32,66.93 0 top
R26  73.79,71.7 270 top
R27  76.02,71.7 90 top
R28  64.59,68.84 0 top
R29  63,66.3 0 top
R30  65.22,62.81 90 top
R31  82.05,64.71 180 top
R32  82.05,71.7 180 top
SERIAL_X  27.22,53.89 90 top
SERIAL_Y  56.11,53.89 90 top
SERIAL_Z  84.37,53.89 90 top
U$1  45,45 0 top
U$2  45,45 0 top
U$3  11.35,56.75 180 bottom
U$4  24.36,32.3 90 top
U$5  22.14,25.32 180 bottom
U$7  18.55,65.66 270 top
U$9  44.37,15.16 180 top
U$10  40.24,56.75 180 bottom
U$11  53.26,32.3 90 top
U$12  47.44,65.66 270 top
U$13  68.5,56.75 180 bottom
U$14  81.51,32.3 90 top
U$15  75.7,65.66 270 top

### Tracks (layer width: path | path; a pad name or v marks a point on that pad's centre or on a via)
+3V3  (via drill 0.35)  (3 unrouted)
  Top 0.254: LDO_3V3.P$5 C16.1 v3.73,76.75 | v9.12,52.62 11.98,49.77 v20.77,49.77 | v38.02,52.62 40.87,49.77 v49.66,49.77 | v66.27,52.62 69.12,49.77 v77.92,49.77
  Bottom 0.254: v3.73,76.75 1.5,76.75 1.5,62.78 2.74,62.78 U$3.3.3V@MSP2 2.86,62.66 U$3.3.3V_ANALOG@MSP2 3.05,51.03 6.9,51.03 | U$3.3.3V@CAN1 8.45,31.62 9.44,32.62 9.44,32.68 9.57,32.81 11.54,32.81 13.57,34.84 13.57,36.75 15.47,38.65 19.44,38.65 U$3.3.3V@CAN2 | U$3.3.3V@MSP1 19.99,50.72 20.78,50.72 | 20.78,50.72 22.78,50.72 23.09,50.4 23.09,50.08 22.85,49.84 22.85,49.15 | 22.85,49.15 22.14,48.44 22.14,39.92 20.23,39.92 | 6.9,51.03 7.54,51.03 6.9,51.03 | 6.9,51.03 6.9,52.3 7.22,52.62 v9.12,52.62 | v20.77,49.77 v20.78,49.77 20.78,50.72 | 31.76,51.43 31.76,62.66 U$10.3.3V@MSP2 31.63,62.78 | 31.76,51.43 U$10.3.3V_ANALOG@MSP2 31.94,51.03 35.79,51.03 | U$10.3.3V@CAN1 37.34,31.62 38.33,32.62 38.33,32.68 38.46,32.81 40.43,32.81 42.46,34.84 42.46,36.75 44.37,38.65 48.34,38.65 U$10.3.3V@CAN2 | U$10.3.3V@MSP1 48.89,50.72 49.67,50.72 | 49.67,50.72 51.67,50.72 51.98,50.4 51.98,50.08 51.74,49.84 51.74,49.15 | 51.74,49.15 51.03,48.44 51.03,39.92 49.13,39.92 | 35.79,51.03 36.43,51.03 35.79,51.03 | 35.79,51.03 35.79,52.3 36.11,52.62 v38.02,52.62 | v49.66,49.77 v49.67,49.77 49.67,50.72 | 60.01,51.43 60.01,62.66 U$13.3.3V@MSP2 59.89,62.78 | 60.01,51.43 U$13.3.3V_ANALOG@MSP2 60.2,51.03 64.05,51.03 | U$13.3.3V@CAN1 65.59,31.62 66.59,32.62 66.59,32.68 66.72,32.81 68.69,32.81 70.72,34.84 70.72,36.75 72.62,38.65 76.59,38.65 U$13.3.3V@CAN2 | U$13.3.3V@MSP1 77.14,50.72 77.92,50.72 | 77.92,50.72 79.92,50.72 80.24,50.4 80.24,50.08 80,49.84 80,49.15 79.29,48.44 79.29,39.92 77.39,39.92 | 64.05,51.03 64.69,51.03 64.05,51.03 | 64.05,51.03 64.05,52.3 64.37,52.62 v66.27,52.62 | v77.92,49.77 77.92,50.72
  Bottom 0.254: 22.85,49.15 23.19,48.81 25.95,48.81 28.57,51.43 31.76,51.43 | 51.74,49.15 52.08,48.81 54.21,48.81 56.83,51.43 60.01,51.43
+5V  (via drill 0.35)
  Top 0.254: LDO_5V.P$5 C17.1 v86.27,78.65 v86.28,78.66
  Bottom 0.254: U$3.5V 18.96,32.22 18.96,30.71 47.86,30.71 | 47.86,30.71 47.86,31.32 47.89,31.35 U$10.5V | 47.86,30.71 76.11,30.71 | 76.11,30.71 76.11,31.32 76.14,31.35 U$13.5V | 76.11,30.71 88.86,30.71 88.86,78.66 v86.28,78.66
BRKMOD_X  (via drill 0.35)
  Top 0.254: U$7.BRKMOD 20.87,67.27 v20.52,66.91
  Signal 0.254: v20.52,66.91 20.21,66.91 19.48,67.64 17.16,67.64 16.74,67.22 v16.74,64.69
  Bottom 0.254: U$3.P4.3_GPIO 12.6,63.42 12.56,63.45 11.94,63.45 11.83,63.57 11.83,66.74 12.49,67.4 16.57,67.4 16.74,67.22 v16.74,64.69
BRKMOD_Y  (via drill 0.35)
  Top 0.254: U$12.BRKMOD 49.77,67.27 v49.41,66.91
  Signal 0.254: v49.41,66.91 49.11,66.91 48.37,67.64 46.05,67.64 45.63,67.22 v45.63,64.69
  Bottom 0.254: U$10.P4.3_GPIO 41.49,63.42 41.45,63.45 40.84,63.45 40.72,63.57 40.72,66.74 41.38,67.4 45.46,67.4 45.63,67.22 v45.63,64.69
BRKMOD_Z  (via drill 0.35)
  Top 0.254: U$15.BRKMOD 78.02,67.27 v77.67,66.91
  Signal 0.254: v77.67,66.91 77.36,66.91 76.63,67.64 74.31,67.64 73.89,67.22 v73.89,64.69
  Bottom 0.254: U$13.P4.3_GPIO 69.75,63.42 69.71,63.45 69.09,63.45 68.98,63.57 68.98,66.74 69.64,67.4 73.72,67.4 73.89,67.22 v73.89,64.69
CANH  (via drill 0.35)
  Top 0.254: v28.81,35.48 29.76,36.43 29.76,65.32 30.39,65.95 30.39,70.08 34.45,74.14 v43.09,74.14
  Signal 0.254: v7.85,35.79 9.12,37.06 21.51,37.06 22.64,35.93 24.94,35.93 25.4,35.48 v28.81,35.48 v36.43,35.48 40,35.48 40.37,35.11 41.11,35.11 42.01,36.01 53.76,36.01 53.97,35.79 v64.69,35.79
  Bottom 0.254: U$3.CANH 9.63,34.91 8.73,34.91 8.54,35.1 8.54,35.11 v7.85,35.79 | v36.43,35.48 37.12,34.79 U$10.CANH | v64.69,35.79 65.69,34.79 U$13.CANH | v43.09,74.14 45.84,76.88 U$2.P$53
CANL  (via drill 0.35)
  Top 0.254: v29.76,33.57 30.22,34.03 30.22,65.13 30.85,65.77 30.85,69.89 34.53,73.57 42.15,73.57 v42.46,73.26
  Signal 0.254: v7.85,34.2 8.49,33.57 v29.76,33.57 v36.43,33.57 v64.69,33.57
  Bottom 0.254: U$3.CANL 9.68,34.2 v7.85,34.2 | v36.43,33.57 37,34.14 U$10.CANL | v64.69,33.57 65.25,34.14 U$13.CANL | v42.46,73.26 43.41,73.26 45.32,75.16 47.09,75.16 U$2.P$57
CMTMOD_X  (via drill 0.35)
  Top 0.305: U$7.CMTMOD 22.67,66.61 v22.99,66.94 | v29.03,68.2 CMTMOD_X.P$2
  Signal 0.305: v29.03,68.2 27.84,68.2 27.74,68.11 24.16,68.11 v22.99,66.94
CMTMOD_Y  (via drill 0.35)
  Top 0.305: U$12.CMTMOD 51.57,66.61 v51.89,66.94 | v57.92,68.2 CMTMOD_Y.P$2
  Signal 0.305: v57.92,68.2 56.73,68.2 56.63,68.11 53.06,68.11 v51.89,66.94
CMTMOD_Z  (via drill 0.35)
  Top 0.305: U$15.CMTMOD 79.82,66.61 v80.14,66.94 | v86.18,68.2 CMTMOD_Z.P$2
  Signal 0.305: v86.18,68.2 84.99,68.2 84.89,68.11 81.31,68.11 v80.14,66.94
CPN_X
  Top 0.305: U$7.CPN 14.66,63.36 14.1,62.81 14.1,62.17 13.79,61.86 C2.1
CPN_Y
  Top 0.305: U$12.CPN 43.55,63.36 43,62.81 43,62.17 42.68,61.86 C12.1
CPN_Z
  Top 0.305: U$15.CPN 71.81,63.36 71.25,62.81 71.25,62.17 70.94,61.86 C19.1
CPP_X
  Top 0.305: U$7.CPP 13.09,64.02 C2.2
CPP_Y
  Top 0.305: U$12.CPP 41.98,64.02 C12.2
CPP_Z
  Top 0.305: U$15.CPP 70.24,64.02 C19.2
CS_X
  Top 0.305: U$7.CS 23.58,64.67 R7.2
CS_Y
  Top 0.305: U$12.CS 52.48,64.67 R23.2
CS_Z
  Top 0.305: U$15.CS 80.73,64.67 R31.2
DAA_X
  Top 0.305: U$7.DAA 12.14,69.22 11.88,69.47 DAA_X.P$2
DAA_Y
  Top 0.305: U$12.DAA 41.03,69.22 40.77,69.47 DAA_Y.P$2
DAA_Z
  Top 0.305: U$15.DAA 69.29,69.22 69.03,69.47 DAA_Z.P$2
EN_UVLO  (via drill 0.35)
  Top 0.254: v23.73,19.6 23.5,19.83 v23.5,23.84
  Bottom 0.254: R12.2 v23.73,19.6 | v23.5,23.84 23.07,24.28 U$5.P$8
FBX  (via drill 0.35)
  Top 0.254: v20.46,23.73 v18.89,23.73
  Bottom 0.254: R14.2 21.21,22.11 U$5.P$1 20.23,24.57 20.23,23.96 v20.46,23.73 | v18.89,23.73 13.25,23.73 12.62,23.09 R13.1
  Bottom 0.508: C27.2 R13.1
FG_X  (via drill 0.35)
  Top 0.254: 21.47,69.86 v21.92,70.3
  Top 0.305: U$7.FG 21.47,69.86 | v21.92,70.3 22.36,70.75 23,70.75 R8.2
  Signal 0.254: v21.92,70.3 21.82,70.21 21.82,68.5 21.51,68.18 10.39,68.18 9.12,66.91 v9.12,65
  Bottom 0.254: v9.12,65 10.6,63.53 U$3.P7.4_GPIO
FG_Y  (via drill 0.35)
  Top 0.254: 50.37,69.86 v50.81,70.3
  Top 0.305: U$12.FG 50.37,69.86 | v50.81,70.3 51.25,70.75 51.89,70.75 R24.2
  Signal 0.254: v50.81,70.3 50.72,70.21 50.72,68.5 50.4,68.18 39.29,68.18 38.02,66.91 v38.02,65
  Bottom 0.254: v38.02,65 39.49,63.53 U$10.P7.4_GPIO
FG_Z  (via drill 0.35)
  Top 0.254: 78.62,69.86 v79.07,70.3
  Top 0.305: U$15.FG 78.62,69.86 | v79.07,70.3 79.51,70.75 80.15,70.75 R32.2
  Signal 0.254: v79.07,70.3 78.97,70.21 78.97,68.5 78.66,68.18 67.54,68.18 66.27,66.91 v66.27,65
  Bottom 0.254: v66.27,65 67.75,63.53 U$13.P7.4_GPIO
FR_X  (via drill 0.35)
  Top 0.254: U$7.FR 20.8,68.56 v20.23,69.13
  Signal 0.254: v8.17,66.27 8.67,66.77 8.67,67.1 10.7,69.13 v20.23,69.13
  Bottom 0.254: U$3.P7.3_GPIO 10.1,63.38 9.18,64.29 8.83,64.29 8.41,64.71 8.41,66.03 v8.17,66.27
FR_Y  (via drill 0.35)
  Top 0.254: U$12.FR 49.69,68.56 v49.13,69.13
  Signal 0.254: v37.06,66.27 37.56,66.77 37.56,67.1 39.59,69.13 v49.13,69.13
  Bottom 0.254: U$10.P7.3_GPIO 38.99,63.38 38.08,64.29 37.72,64.29 37.31,64.71 37.31,66.03 v37.06,66.27
FR_Z  (via drill 0.35)
  Top 0.254: U$15.FR 77.95,68.56 v77.39,69.13
  Signal 0.254: v65.32,66.27 65.81,66.77 65.81,67.1 67.85,69.13 v77.39,69.13
  Bottom 0.254: U$13.P7.3_GPIO 67.25,63.38 66.33,64.29 65.98,64.29 65.56,64.71 65.56,66.03 v65.32,66.27
GND  (via drill 0.3, 0.35)
  Top 0.254: v28.71,66.62 28.71,66.94 CMTMOD_X.P$1 29.34,66.94 v29.34,66.62 | v23.95,56.77 23.95,57.41 C4.1 | C4.1 | v24.58,56.77 24.58,57.41 C4.1 | v10.29,60.9 10.29,61.73 C3.1 10.93,61.73 v10.93,60.9 | v14.42,70.11 14.1,70.11 DAA_X.P$1 14.1,70.75 v14.42,70.75 | v16.96,73.6 16.96,72.97 R2.1 16.33,72.97 v16.33,73.6 | v27.44,69.79 26.62,69.79 C1.2 26.62,69.16 v27.44,69.16 | v26.8,65.03 26.17,65.03 R7.1 arc-90 v26.8,64.39 | v27.12,62.49 26.3,62.49 26.07,62.27 | 26.07,62.27 C5.1 | v27.12,61.86 26.49,61.86 26.07,62.27 | v18.55,65.03 v19.18,64.39 | v18.55,65.03 v18.55,64.39 U$7.GND@2 | v18.55,65.03 v17.91,64.39 | U$7.GND@2 v17.91,65.03 | U$7.GND@2 v18.55,65.03 | U$7.GND@2 v19.18,65.03 | U$7.GND@2 v19.18,65.67 | U$7.GND@2 v17.91,65.67 | U$7.GND@2 v17.91,66.3 | U$7.GND@2 v19.18,66.3 | v18.55,66.3 v19.18,66.94 | U$7.GND@2 v18.55,66.94 | U$7.GND@2 v18.55,66.3 | v18.55,66.3 v17.91,66.94 | LDO_5V.P$2 v78.97,77.7 | LDO_3V3.P$2 v11.35,77.7 | v57.6,66.62 57.6,66.94 CMTMOD_Y.P$1 58.24,66.94 v58.24,66.62 | v52.84,56.77 52.84,57.41 C14.1 | C14.1 | v53.47,56.77 53.47,57.41 C14.1 | v39.19,60.9 39.19,61.73 C13.1 39.82,61.73 v39.82,60.9 | v43.31,70.11 42.99,70.11 DAA_Y.P$1 42.99,70.75 v43.31,70.75 | v45.85,73.6 45.85,72.97 R18.1 45.22,72.97 v45.22,73.6 | v56.33,69.79 55.51,69.79 C11.2 55.51,69.16 v56.33,69.16 | v55.7,65.03 55.06,65.03 R23.1 arc-90 v55.7,64.39 | v56.01,62.49 55.19,62.49 54.97,62.27 | 54.97,62.27 C15.1 | v56.01,61.86 55.38,61.86 54.97,62.27 | v47.44,65.03 v48.08,64.39 | v47.44,65.03 v47.44,64.39 U$12.GND@2 | v47.44,65.03 v46.81,64.39 | U$12.GND@2 v46.81,65.03 | U$12.GND@2 v47.44,65.03 | U$12.GND@2 v48.08,65.03 | U$12.GND@2 v48.08,65.67
  Top 0.254: U$12.GND@2 v46.81,65.67 | U$12.GND@2 v46.81,66.3 | U$12.GND@2 v48.08,66.3 | v47.44,66.3 v48.08,66.94 | U$12.GND@2 v47.44,66.94 | U$12.GND@2 v47.44,66.3 | v47.44,66.3 v46.81,66.94 | v85.86,66.62 85.86,66.94 CMTMOD_Z.P$1 86.49,66.94 v86.49,66.62 | v81.1,56.77 81.1,57.41 C21.1 | C21.1 | v81.73,56.77 81.73,57.41 C21.1 | v67.44,60.9 67.44,61.73 C20.1 68.08,61.73 v68.08,60.9 | v71.57,70.11 71.25,70.11 DAA_Z.P$1 71.25,70.75 v71.57,70.75 | v74.11,73.6 74.11,72.97 R26.1 73.48,72.97 v73.48,73.6 | v84.59,69.79 83.77,69.79 C18.2 83.77,69.16 v84.59,69.16 | v83.95,65.03 83.32,65.03 R31.1 arc-90 v83.95,64.39 | v84.27,62.49 83.45,62.49 83.22,62.27 | 83.22,62.27 C22.1 | v84.27,61.86 83.64,61.86 83.22,62.27 | v75.7,65.03 v76.33,64.39 | v75.7,65.03 v75.7,64.39 U$15.GND@2 | v75.7,65.03 v75.06,64.39 | U$15.GND@2 v75.06,65.03 | U$15.GND@2 v75.7,65.03 | U$15.GND@2 v76.33,65.03 | U$15.GND@2 v76.33,65.67 | U$15.GND@2 v75.06,65.67 | U$15.GND@2 v75.06,66.3 | U$15.GND@2 v76.33,66.3 | v75.7,66.3 v76.33,66.94 | U$15.GND@2 v75.7,66.94 | U$15.GND@2 v75.7,66.3 | v75.7,66.3 v75.06,66.94
  Top 0.305: v14.74,58.68 15,58.94 MOTOR_X.P$4 | U$7.GND@1 16.22,62.06 v16.64,62.49 | v43.63,58.68 43.89,58.94 MOTOR_Y.P$4 | U$12.GND@1 45.11,62.06 v45.54,62.49 | v71.89,58.68 72.15,58.94 MOTOR_Z.P$4 | U$15.GND@1 73.37,62.06 v73.79,62.49
  Bottom 0.254: U$5.P$5 22.26,26.07 22.14,25.95 U$5.GND | L2.P$2 v15.53,22.09 v15.52,22.09 | v21.82,18.96 21.51,19.28 | v21.19,18.96 21.51,19.28 | 21.51,19.28 R14.1 | v25.95,29.44 25.95,28.8 C23.2 25.32,28.8 v25.32,29.44 | v26.27,21.51 26.27,22.14 26.43,22.3 | 26.43,22.3 C24.2 | v26.9,21.51 26.9,21.82 26.43,22.3
  Bottom 0.508: v22.14,23.73 U$5.GND v22.14,26.9 | v13.62,27.8 13.62,28.76 C26.2
  other vias: 18.55,65.66 47.44,65.66 75.7,65.66
  pour Ground: -0.72,84.37 -0.72,85.64 4.36,90.72 85.64,90.72 90.72,85.64 90.72,4.36 85.64,-0.72 4.36,-0.72 -0.72,4.36
GPIO_DEBUG_3.4_X  (via drill 0.35)
  Top 0.254: v15.47,55.15 v15.48,55.16 18.32,55.16 23.09,50.39 23.09,48.18 23.73,47.54 U$4.7
  Bottom 0.254: v15.47,55.15 15.22,55.4 15.18,55.4 14.03,56.55 14.03,59.2 14.33,59.5 U$3.P3.4_GPIO_DEBUG
GPIO_DEBUG_3.4_Y  (via drill 0.35)
  Top 0.254: v44.37,55.15 v44.37,55.16 47.21,55.16 51.98,50.39 51.98,48.18 52.62,47.54 U$11.7
  Bottom 0.254: v44.37,55.15 44.11,55.4 44.07,55.4 42.92,56.55 42.92,59.2 43.23,59.5 U$10.P3.4_GPIO_DEBUG
GPIO_DEBUG_3.4_Z  (via drill 0.35)
  Top 0.254: v72.62,55.15 v72.63,55.16 75.47,55.16 80.24,50.39 80.24,48.18 80.88,47.54 U$14.7
  Bottom 0.254: v72.62,55.15 72.37,55.4 72.33,55.4 71.18,56.55 71.18,59.2 71.48,59.5 U$13.P3.4_GPIO_DEBUG
GPIO_DEBUG_3.5_X  (via drill 0.35)
  Top 0.254: v15.47,56.11 18.01,56.11 24.05,50.08 U$4.8
  Bottom 0.254: U$3.P3.5_GPIO_DEBUG 15.82,59 15.47,58.65 v15.47,56.11
GPIO_DEBUG_3.5_Y  (via drill 0.35)
  Top 0.254: v44.37,56.11 46.91,56.11 52.94,50.08 U$11.8
  Bottom 0.254: U$10.P3.5_GPIO_DEBUG 44.71,59 44.37,58.65 v44.37,56.11
GPIO_DEBUG_3.5_Z  (via drill 0.35)
  Top 0.254: v72.62,56.11 75.16,56.11 81.2,50.08 U$14.8
  Bottom 0.254: U$13.P3.5_GPIO_DEBUG 72.97,59 72.62,58.65 v72.62,56.11
HN_X
  Top 0.254: 16.64,66.62 16.64,67.89
  Top 0.305: U$7.W_HN 16.29,65.31 16.64,65.67 16.64,66.62 U$7.V_HN | U$7.U_HN 16.3,67.92 16.33,67.89 16.64,67.89 R2.2 R3.1
HN_Y
  Top 0.254: 45.54,66.62 45.54,67.89
  Top 0.305: U$12.W_HN 45.19,65.31 45.54,65.67 45.54,66.62 U$12.V_HN | U$12.U_HN 45.19,67.92 45.22,67.89 45.54,67.89 R18.2 R19.1
HN_Z
  Top 0.254: 73.79,66.62 73.79,67.89
  Top 0.305: U$15.W_HN 73.44,65.31 73.79,65.67 73.79,66.62 U$15.V_HN | U$15.U_HN 73.45,67.92 73.48,67.89 73.79,67.89 R26.2 R27.1
HP_U_X
  Top 0.305: 9.02,59.66 MOTOR_X.P$8 6.17,59.63 5.53,60.27 5.53,63.44 5.21,63.76 2.99,63.76 2.99,67.57 4.26,67.57 5.21,68.52 5.21,70.11 8.39,70.11 R4.2 | R4.2 8.07,68.53 | R4.2 8.66,68.56 U$7.U_HP
HP_U_Y
  Top 0.305: 37.92,59.66 MOTOR_Y.P$8 35.06,59.63 34.42,60.27 34.42,63.44 34.11,63.76 31.88,63.76 31.88,67.57 33.15,67.57 34.11,68.52 34.11,70.11 37.28,70.11 R20.2 | R20.2 36.96,68.53 | R20.2 37.55,68.56 U$12.U_HP
HP_U_Z
  Top 0.305: 66.17,59.66 MOTOR_Z.P$8 63.32,59.63 62.68,60.27 62.68,63.44 62.36,63.76 60.14,63.76 60.14,67.57 61.41,67.57 62.36,68.52 62.36,70.11 65.54,70.11 R28.2 | R28.2 65.22,68.53 | R28.2 65.81,68.56 U$15.U_HP
HP_V_X
  Top 0.152: 9.02,62.81 7.12,62.81
  Top 0.305: U$7.V_HP 7.76,67.27 R5.2 6.8,62.81 7.12,62.81 | MOTOR_X.P$7 9.98,59.63 9.66,59.95 9.66,60.28 9.34,60.59 9.34,62.81 9.02,62.81
HP_V_Y
  Top 0.152: 37.92,62.81 36.01,62.81
  Top 0.305: U$12.V_HP 36.66,67.27 R21.2 35.69,62.81 36.01,62.81 | MOTOR_Y.P$7 38.87,59.63 38.55,59.95 38.55,60.28 38.23,60.59 38.23,62.81 37.92,62.81
HP_V_Z
  Top 0.152: 66.17,62.81 64.27,62.81
  Top 0.305: U$15.V_HP 64.91,67.27 R29.2 63.95,62.81 64.27,62.81 | MOTOR_Z.P$7 67.13,59.63 66.81,59.95 66.81,60.28 66.49,60.59 66.49,62.81 66.17,62.81
HP_W_X
  Top 0.305: U$7.W_HP 15.61,65.98 14.74,65.98 14.74,66.62 9.66,66.62 8.07,65.03 R6.2 8.39,63.44 11.88,63.44 11.88,60.07 MOTOR_X.P$6
HP_W_Y
  Top 0.305: U$12.W_HP 44.5,65.98 43.63,65.98 43.63,66.62 38.55,66.62 36.96,65.03 R22.2 37.28,63.44 40.77,63.44 40.77,60.07 MOTOR_Y.P$6
HP_W_Z
  Top 0.305: U$15.W_HP 72.76,65.98 71.89,65.98 71.89,66.62 66.81,66.62 65.22,65.03 R30.2 65.54,63.44 69.03,63.44 69.03,60.07 MOTOR_Z.P$6
INT_VCC
  Bottom 0.254: U$5.P$7 24.3,25.07 25,24.36 C24.1
M_X_RX
  Bottom 0.254: U$3.P2.6_GPIO/PWM 13.6,60.48 14.12,59.96 14.71,59.96 16.36,61.61 21.38,61.61 21.8,61.2 21.8,57.09 23.25,55.64 26.55,55.64 SERIAL_X.2
M_X_TX
  Bottom 0.254: U$3.P2.5_GPIO 13.1,52.46 13.25,52.3 17.78,52.3 18.48,51.61 24.81,51.61 SERIAL_X.1
M_Y_RX
  Bottom 0.254: U$10.P2.6_GPIO/PWM 42.49,60.48 43.01,59.96 43.6,59.96 45.25,61.61 50.27,61.61 50.69,61.2 50.69,57.09 52.14,55.64 55.45,55.64 SERIAL_Y.2
M_Y_TX
  Bottom 0.254: U$10.P2.5_GPIO 41.99,52.46 42.14,52.3 46.68,52.3 47.37,51.61 53.7,51.61 SERIAL_Y.1
M_Z_RX
  Bottom 0.254: U$13.P2.6_GPIO/PWM 70.75,60.48 71.27,59.96 71.86,59.96 73.51,61.61 78.53,61.61 78.95,61.2 78.95,57.09 80.4,55.64 83.7,55.64 SERIAL_Z.2
M_Z_TX
  Bottom 0.254: U$13.P2.5_GPIO 70.25,52.46 70.4,52.3 74.93,52.3 75.63,51.61 81.96,51.61 SERIAL_Z.1
N$1
  Bottom 0.508: C25.2 D2.P$1 19.28,28.81 18.33,27.86 16.74,27.86 16.43,27.54 15.53,26.64 L2.P$1
N$13
  Top 0.254: LDO_5V.P$4 C17.2
N$14
  Top 0.254: LDO_3V3.P$4 C16.2
PWM_X  (via drill 0.35)
  Top 0.305: U$7.PWM 21.07,65.97 v20.45,65.35
  Signal 0.254: v20.45,65.35 20.45,63.95 19.6,63.1 18.65,63.1 v18.65,56.99
  Bottom 0.254: v18.65,56.99 U$3.P1.7_GPIO/PWM
PWM_Y  (via drill 0.35)
  Top 0.305: U$12.PWM 49.96,65.97 v49.35,65.35
  Signal 0.254: v49.35,65.35 49.35,63.95 49.13,63.73 v49.13,57.31
  Bottom 0.254: U$10.P1.7_GPIO/PWM 48.81,57 v49.13,57.31
PWM_Z  (via drill 0.35)
  Top 0.305: U$15.PWM 78.22,65.97 v77.6,65.35
  Signal 0.254: v77.6,65.35 77.6,63.95 76.75,63.1 75.8,63.1 v75.8,56.99
  Bottom 0.254: v75.8,56.99 U$13.P1.7_GPIO/PWM
RD_X  (via drill 0.35)
  Top 0.305: U$7.RD 22.33,65.31 22.36,65.35 22.36,65.98 25.22,65.98 R1.1 | R1.1 25,66.94 | R1.1 v24.26,66.94
  Bottom 0.254: 11.1,63.21 U$3.P4.0_GPIO 11.1,66.66 12.3,67.86 23.34,67.86 v24.26,66.94
RD_Y  (via drill 0.35)
  Top 0.305: U$12.RD 51.22,65.31 51.25,65.35 51.25,65.98 54.11,65.98 R17.1 | R17.1 53.89,66.94 | R17.1 v53.16,66.94
  Bottom 0.254: 39.99,63.21 U$10.P4.0_GPIO 39.99,66.66 41.19,67.86 52.23,67.86 v53.16,66.94
RD_Z  (via drill 0.35)
  Top 0.305: U$15.RD 79.48,65.31 79.51,65.35 79.51,65.98 82.37,65.98 R25.1 | R25.1 82.15,66.94 | R25.1 v81.41,66.94
  Bottom 0.254: 68.25,63.21 U$13.P4.0_GPIO 68.25,66.66 69.45,67.86 80.49,67.86 v81.41,66.94
RETRY_X
  Top 0.305: U$7.RETRY 22.26,67.92 23.5,69.16 C1.1
RETRY_Y
  Top 0.305: U$12.RETRY 51.15,67.92 52.39,69.16 C11.1
RETRY_Z
  Top 0.305: U$15.RETRY 79.41,67.92 80.65,69.16 C18.1
RXD_X  (via drill 0.35)
  Top 0.254: U$4.4 22.64,41.77 22.64,50.08 v22.14,50.08
  Signal 0.254: v22.14,50.08 22.14,57.89 v20.38,59.65
  Bottom 0.254: v20.38,59.65 19.53,60.5 U$3.P2.1_RXD
RXD_Y  (via drill 0.35)
  Top 0.254: U$11.4 51.53,41.77 51.53,50.08 v51.03,50.08
  Signal 0.254: v51.03,50.08 51.03,57.89 v49.27,59.65
  Bottom 0.254: v49.27,59.65 48.42,60.5 U$10.P2.1_RXD
RXD_Z  (via drill 0.35)
  Top 0.254: U$14.4 79.78,41.77 79.78,50.08 v79.29,50.08
  Signal 0.254: v79.29,50.08 79.29,57.89 v77.53,59.65
  Bottom 0.254: v77.53,59.65 76.68,60.5 U$13.P2.1_RXD
SBWTCK_X  (via drill 0.35)
  Top 0.254: U$4.SBWTCK 21.19,35.35 21.19,46.27 v20.55,46.27
  Signal 0.254: v20.55,46.27 19.59,46.27 19.02,45.7 18.28,45.7 17.76,46.22 17.76,47.47 13.11,52.11 13.11,65.27 v12.62,65.76
  Bottom 0.254: v12.62,65.76 14.1,64.28 U$3.SBWTCK
SBWTCK_Y  (via drill 0.35)
  Top 0.254: U$11.SBWTCK 50.08,35.35 50.08,46.27 v49.45,46.27
  Signal 0.254: v49.45,46.27 48.48,46.27 47.91,45.7 47.17,45.7 46.65,46.22 46.65,47.47 42,52.11 42,65.27 v41.51,65.76
  Bottom 0.254: v41.51,65.76 42.99,64.28 U$10.SBWTCK
SBWTCK_Z  (via drill 0.35)
  Top 0.254: U$14.SBWTCK 78.34,35.35 78.34,46.27 v77.7,46.27
  Signal 0.254: v77.7,46.27 76.74,46.27 76.17,45.7 75.43,45.7 74.91,46.22 74.91,47.47 70.26,52.11 70.26,65.27 v69.77,65.76
  Bottom 0.254: v69.77,65.76 71.25,64.28 U$13.SBWTCK
SBWTDIO_X  (via drill 0.35)
  Top 0.254: U$4.2 21.68,37.65 21.68,47.54 v21.19,47.54
  Signal 0.254: v13.89,65.76 13.57,65.45 13.57,52.3 18.33,47.54 v21.19,47.54
  Bottom 0.254: v13.89,65.76 14.6,65.05 U$3.SBWTDIO
SBWTDIO_Y  (via drill 0.35)
  Top 0.254: U$11.2 50.58,37.65 50.58,47.54 v50.08,47.54
  Signal 0.254: v42.78,65.76 42.46,65.45 42.46,52.3 47.22,47.54 v50.08,47.54
  Bottom 0.254: v42.78,65.76 43.49,65.05 U$10.SBWTDIO
SBWTDIO_Z  (via drill 0.35)
  Top 0.254: U$14.2 78.83,37.65 78.83,47.54 v78.34,47.54
  Signal 0.254: v71.03,65.76 70.72,65.45 70.72,52.3 75.48,47.54 v78.34,47.54
  Bottom 0.254: v71.03,65.76 71.75,65.05 U$13.SBWTDIO
SW
  Bottom 0.254: L2.P$3 17.44,20.87 18.33,20.87 19.6,22.14 19.6,25.32 19.85,25.57 U$5.P$3 U$5.P$4 21.19,26.09 21.19,26.9 21.43,27.15 21.43,27.42 22.77,28.76 C25.1
SYNC1  (via drill 0.35)
  Top 0.254: v38.97,57.06 43.09,57.06 43.54,57.51 44.34,57.51 44.41,57.59 47.53,57.59 48.83,56.29 49.83,56.29 v50.08,56.54
  Signal 0.254: 37.09,56.36 37.67,56.36 38.68,57.36 v38.97,57.06 | U$2.P$45 41.19,75.84 35.9,70.55 35.9,57.55 37.09,56.36 | v9.76,56.75 9.76,54.82 15.85,48.72 15.85,46.22 16.83,45.24 21.58,45.24 23.09,43.73 25.63,43.73 37.09,55.18 37.09,56.36 | v65.95,56.43 v65.95,56.42 64.69,55.16 52.94,55.16 v52.94,54.52
  Bottom 0.254: U$3.P7.2_SYNC1 9.58,62.33 9.58,57.51 9.76,57.33 v9.76,56.75 | U$10.P7.2_SYNC1 38.49,61.43 38.48,61.42 38.48,57.55 v38.97,57.06 | U$13.P7.2_SYNC1 66.75,61.43 66.73,61.42 66.73,57.16 66.25,56.67 66.21,56.67 v65.95,56.42 | v52.94,54.52 52.28,55.18 51.95,55.18 50.6,56.54 v50.08,56.54
SYNC2  (via drill 0.35)
  Top 0.254: v38.02,55.16 38.33,55.16 39.78,56.61 43.28,56.61 43.46,56.79 44.04,56.79 44.07,56.82 47.54,56.82 | 47.54,56.82 47.65,56.82 | 47.54,56.82 47.65,56.82 | 47.65,56.82 48.65,55.83 51.62,55.83 51.8,55.66 55.22,55.66 55.71,55.16 58.65,55.16 60.88,57.38 v65.95,57.38
  Signal 0.254: v37.38,57.06 37.38,58.18 37.65,58.45 37.65,64.37 36.35,65.66 36.35,69.5 U$2.P$49 | v8.73,56.75 9.05,56.43 9.05,54.88 15.4,48.53 15.4,46.03 20.06,41.37 24.69,41.37 25.33,42.01 25.33,42.78 37.71,55.16 v38.02,55.16
  Bottom 0.254: U$3.PJ.3_SYNC2 9.12,62.32 9.12,57.7 8.73,57.31 v8.73,56.75 | U$10.PJ.3_SYNC2 37.99,57.67 v37.38,57.06 37.38,55.8 v38.02,55.16 | U$13.PJ.3_SYNC2 66.25,57.67 v65.95,57.38
TXD_X  (via drill 0.35)
  Top 0.254: U$4.3 22.14,39.48 22.14,48.81 v21.51,48.81
  Signal 0.254: v14.41,60.67 14.41,59.36 14.03,58.97 14.03,55.02 20.23,48.81 v21.51,48.81
  Bottom 0.254: U$3.P2.0_TXD 15.1,61.35 v14.41,60.67
TXD_Y  (via drill 0.35)
  Top 0.254: U$11.3 51.03,39.48 51.03,48.81 v50.4,48.81
  Signal 0.254: v43.3,60.67 43.3,59.36 42.92,58.97 42.92,55.02 49.13,48.81 v50.4,48.81
  Bottom 0.254: U$10.P2.0_TXD 43.99,61.35 v43.3,60.67
TXD_Z  (via drill 0.35)
  Top 0.254: U$14.3 79.29,39.48 79.29,48.81 v78.66,48.81
  Signal 0.254: v71.56,60.67 71.56,59.36 71.18,58.97 71.18,55.02 77.39,48.81 v78.66,48.81
  Bottom 0.254: U$13.P2.0_TXD 72.25,61.35 v71.56,60.67
U_X
  Top 0.305: U$7.U 18.14,62.72 16.5,61.08 MOTOR_X.P$3
U_Y
  Top 0.305: U$12.U 47.03,62.72 45.39,61.08 MOTOR_Y.P$3
U_Z
  Top 0.305: U$15.U 75.29,62.72 73.65,61.08 MOTOR_Z.P$3
V_X
  Top 0.305: U$7.V 18.44,62.06 18,61.62 MOTOR_X.P$2
V_Y
  Top 0.305: U$12.V 47.33,62.06 46.89,61.62 MOTOR_Y.P$2
V_Z
  Top 0.305: U$15.V 75.59,62.06 75.15,61.62 MOTOR_Z.P$2
VBAT  (via drill 0.35)  (1 unrouted)
  Top 0.254: 64.05,81.22 62.78,79.95 62.78,78.89 64.05,77.62 | U$2.P$83 64.05,81.22 | 64.05,81.22 65.32,79.95 65.32,78.89 64.05,77.62 | 64.05,77.62 U$2.P$81 64.05,75.48 | 64.05,75.48 64.69,74.84 81.2,74.84 81.2,78.34 80.88,78.65 LDO_5V.P$1 | 64.05,75.48 63.42,74.84 10.71,74.84 10.16,75.4 LDO_3V3.P$1 | v25.18,25.18 25.18,22.96 v25,22.78
  Top 0.508: v18.65,25.63 23.73,25.63 v24.2,26.11
  Bottom 0.254: U$5.P$6 23.66,25.57 v24.2,26.11 | R12.1 23.73,22.78 | R12.1 | C23.1 25.63,25.63 v25.18,25.18 | v25,22.78 24.05,22.78 R12.1
  Bottom 0.508: 28.49,27.86 27.22,26.59 C23.1 24.68,26.59 v24.2,26.11 | L2.P$4 18.22,26.06 v18.65,25.63
VCP_X
  Top 0.305: C3.2 10.8,65.03 14.74,65.03 15.1,64.67 U$7.VCP
VCP_Y
  Top 0.305: C13.2 39.69,65.03 43.63,65.03 44,64.67 U$12.VCP
VCP_Z
  Top 0.305: C20.2 67.95,65.03 71.89,65.03 72.25,64.67 U$15.VCP
VINT_X  (via drill 0.35)
  Top 0.254: C4.2 23.44,59.63 23.07,60 21.77,60 21.6,59.83
  Top 0.305: R4.1 4.9,67.25 R5.1 4.9,65.35 5.02,65.22 5.74,65.22 6.04,64.92 6.04,61.98 6.17,61.86 R6.1 | R6.1 | MOTOR_X.P$5 13.47,59.6 13.47,58.68 | 13.47,58.68 8.07,58.68 8.07,59 8.05,58.97 v8.05,58.74 | v8.05,60.52 8.07,60.54 R6.1 | 13.47,58.68 14.42,57.73 19.5,57.73 21.6,59.83 | 24.26,63.44 24.58,63.12 24.58,59.95 24.26,59.95 C4.2 | U$7.VINT 22.42,64.02 22.68,63.76 22.68,63.44 24.26,63.44 | 24.26,63.44 27.76,63.44 27.76,64.39 28.07,64.71 28.07,65.98 R1.2 27.12,67.25 26.17,68.2 25.22,68.2 24.9,68.52 24.9,70.74 24.95,70.8 R8.1 | R8.1 27.44,71.7 28.07,71.06 CMTMOD_X.P$3 | 24.75,72.8 | R8.1 24.75,72.8 | DAA_X.P$3 9.98,71.39 10.93,72.33 13.8,72.33 15.8,74.34 18.33,74.34 18.55,74.12 18.55,72.65 R3.2 19.19,72.97 24.58,72.97 24.75,72.8
  Signal 0.305: v8.05,58.74 v8.05,60.52
VINT_Y  (via drill 0.35)
  Top 0.254: 51.57,60.9 48.71,58.05 44.22,58.05 44.15,57.97 42.51,57.97 42.43,58.05 | 42.36,58.68 42.36,58.12 | 42.43,58.05 42.36,58.12 | 42.36,58.12 42.43,58.05
  Top 0.305: R20.1 33.79,67.25 R21.1 33.79,65.35 33.91,65.22 34.63,65.22 34.93,64.92 34.93,61.98 35.06,61.86 R22.1 | R22.1 | MOTOR_Y.P$5 42.36,59.6 42.36,58.68 36.96,58.68 36.96,59 36.94,58.97 v36.94,58.74 | v36.94,60.52 36.96,60.54 R22.1 | 53.16,60.9 53.47,60.9 53.47,63.12 53.16,63.44 | 53.16,60.9 51.57,60.9 | U$12.VINT 51.31,64.02 51.57,63.76 51.57,63.44 53.16,63.44 | C14.2 53.16,60.9 | 53.16,63.44 56.65,63.44 56.65,64.39 56.97,64.71 56.97,65.98 R17.2 56.01,67.25 55.06,68.2 54.11,68.2 53.79,68.52 53.79,70.74 53.85,70.8 R24.1 | R24.1 56.33,71.7 56.97,71.06 CMTMOD_Y.P$3 | 53.64,72.8 | R24.1 53.64,72.8 | DAA_Y.P$3 38.87,71.39 39.82,72.33 42.69,72.33 44.69,74.34 47.22,74.34 47.44,74.12 47.44,72.65 R19.2 48.08,72.97 53.47,72.97 53.64,72.8
  Signal 0.305: v36.94,58.74 v36.94,60.52
VINT_Z  (via drill 0.35)
  Top 0.305: R28.1 62.05,67.25 R29.1 62.05,65.35 62.17,65.22 62.89,65.22 63.19,64.92 63.19,61.98 63.32,61.86 R30.1 | R30.1 | MOTOR_Z.P$5 70.62,59.6 70.62,58.68 | 70.62,58.68 65.22,58.68 65.22,59 65.2,58.97 v65.2,58.74 | v65.2,60.52 65.22,60.54 R30.1 | 70.62,58.68 71.57,57.73 76.65,57.73 79.83,60.9 81.41,60.9 | 81.41,60.9 81.73,60.9 81.73,63.12 81.41,63.44 | U$15.VINT 79.57,64.02 79.83,63.76 79.83,63.44 81.41,63.44 | C21.2 81.41,60.9 | 81.41,63.44 84.91,63.44 84.91,64.39 85.22,64.71 85.22,65.98 R25.2 84.27,67.25 83.32,68.2 82.37,68.2 82.05,68.52 82.05,70.74 82.1,70.8 R32.1 | R32.1 84.59,71.7 85.22,71.06 CMTMOD_Z.P$3 | 81.89,72.8 | R32.1 81.89,72.8 | DAA_Z.P$3 67.13,71.39 68.08,72.33 70.95,72.33 72.95,74.34 75.48,74.34 75.7,74.12 75.7,72.65 R27.2 76.34,72.97 81.73,72.97 81.89,72.8
  Signal 0.305: v65.2,58.74 v65.2,60.52
VM  (via drill 0.35)  (1 unrouted)
  Top 0.254: 21.41,60.9 v21.09,60.9 v20.45,60.9 | v49.98,60.9 50.3,60.9 | 78.56,60.9 v78.24,60.9 v77.6,60.9
  Top 0.305: U$7.VM 21.99,63.36 C5.2 22.68,62.17 21.41,60.9 | U$12.VM 50.88,63.36 C15.2 51.57,62.17 50.3,60.9 | U$15.VM 79.14,63.36 C22.2 79.83,62.17 78.56,60.9
  Top 0.508: v13.57,30.39 14.08,30.9 25.37,30.9 25.89,31.43 v25.89,38.02 25.89,50.66 25,51.55 25,54.32 23.06,56.26 23.06,59.01 v22.78,59.29 | v22.78,60.7 22.78,61.77 C5.2
  Signal 0.508: v22.78,59.29 v22.78,60.7 | v49.98,60.9 49.98,60.12 51.87,58.23 51.87,47.51 51.03,46.68 51.03,44.37 44.68,38.02 v25.89,38.02
  Bottom 0.508: D2.P$2 C26.1 15.47,30.08 15.16,30.39 v13.57,30.39 12.3,30.39 11.35,29.44 C27.1 10.71,27.54 9.76,26.59 9.76,22.14 10.71,21.19 R13.2
W_X
  Top 0.305: U$7.W 14.96,62.72 14.74,62.49 14.74,61.54 15.69,60.59 15.69,59 16.01,58.68 19.18,58.68 19.5,59 MOTOR_X.P$1
W_Y
  Top 0.305: U$12.W 43.86,62.72 43.63,62.49 43.63,61.54 44.58,60.59 44.58,59 44.9,58.68 48.08,58.68 48.39,59 MOTOR_Y.P$1
W_Z
  Top 0.305: U$15.W 72.11,62.72 71.89,62.49 71.89,61.54 72.84,60.59 72.84,59 73.16,58.68 76.33,58.68 76.65,59 MOTOR_Z.P$1